# EAGLE design ARE_entrenadora_modular_Arduino_mod (EAGLE 6.5.0)
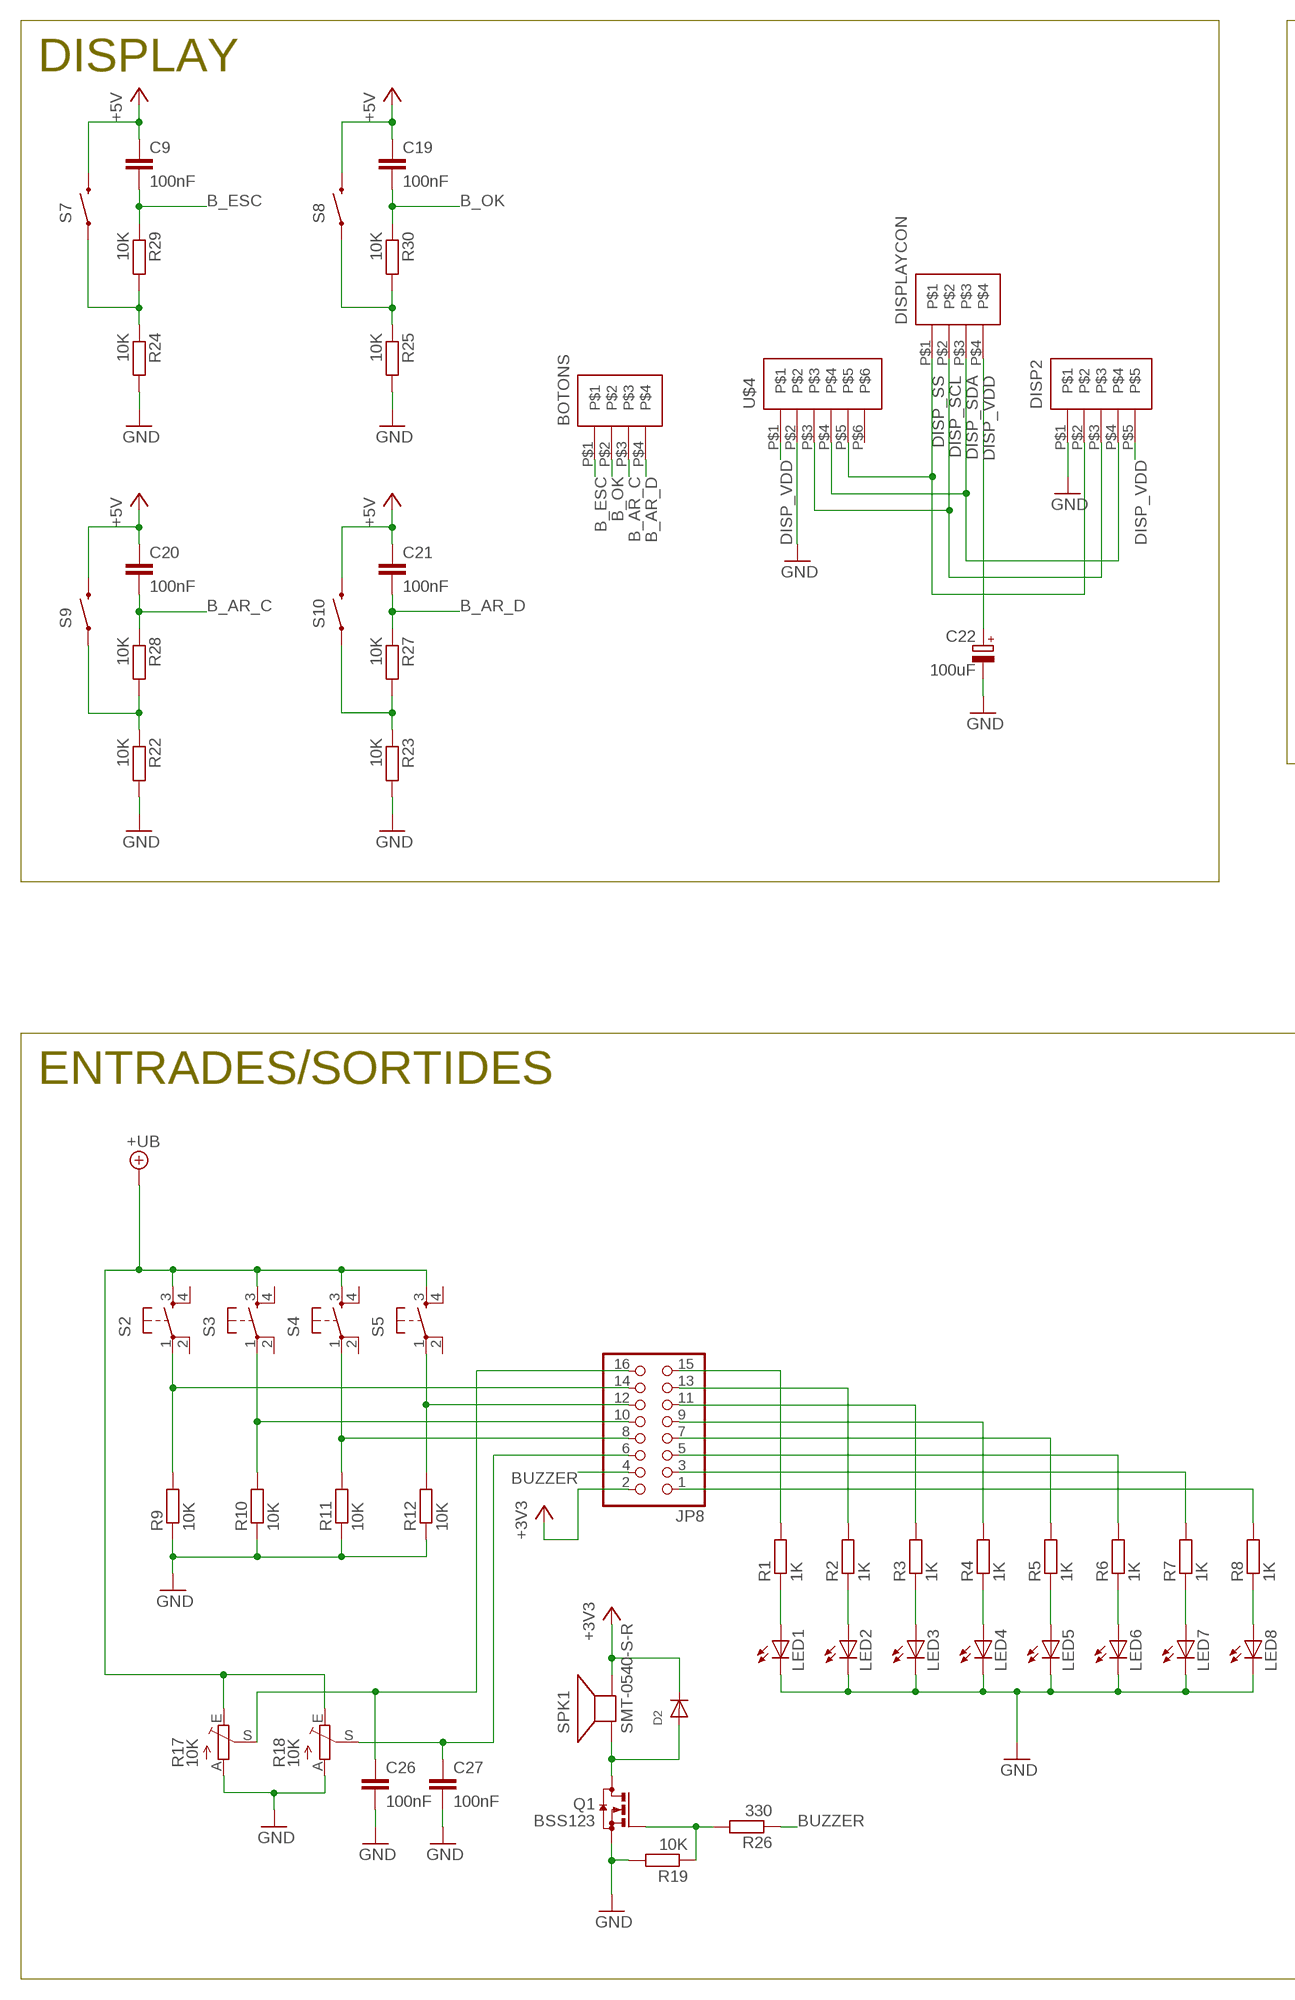
[diagram p0: schematic, sheet 1, part 1 of 2]
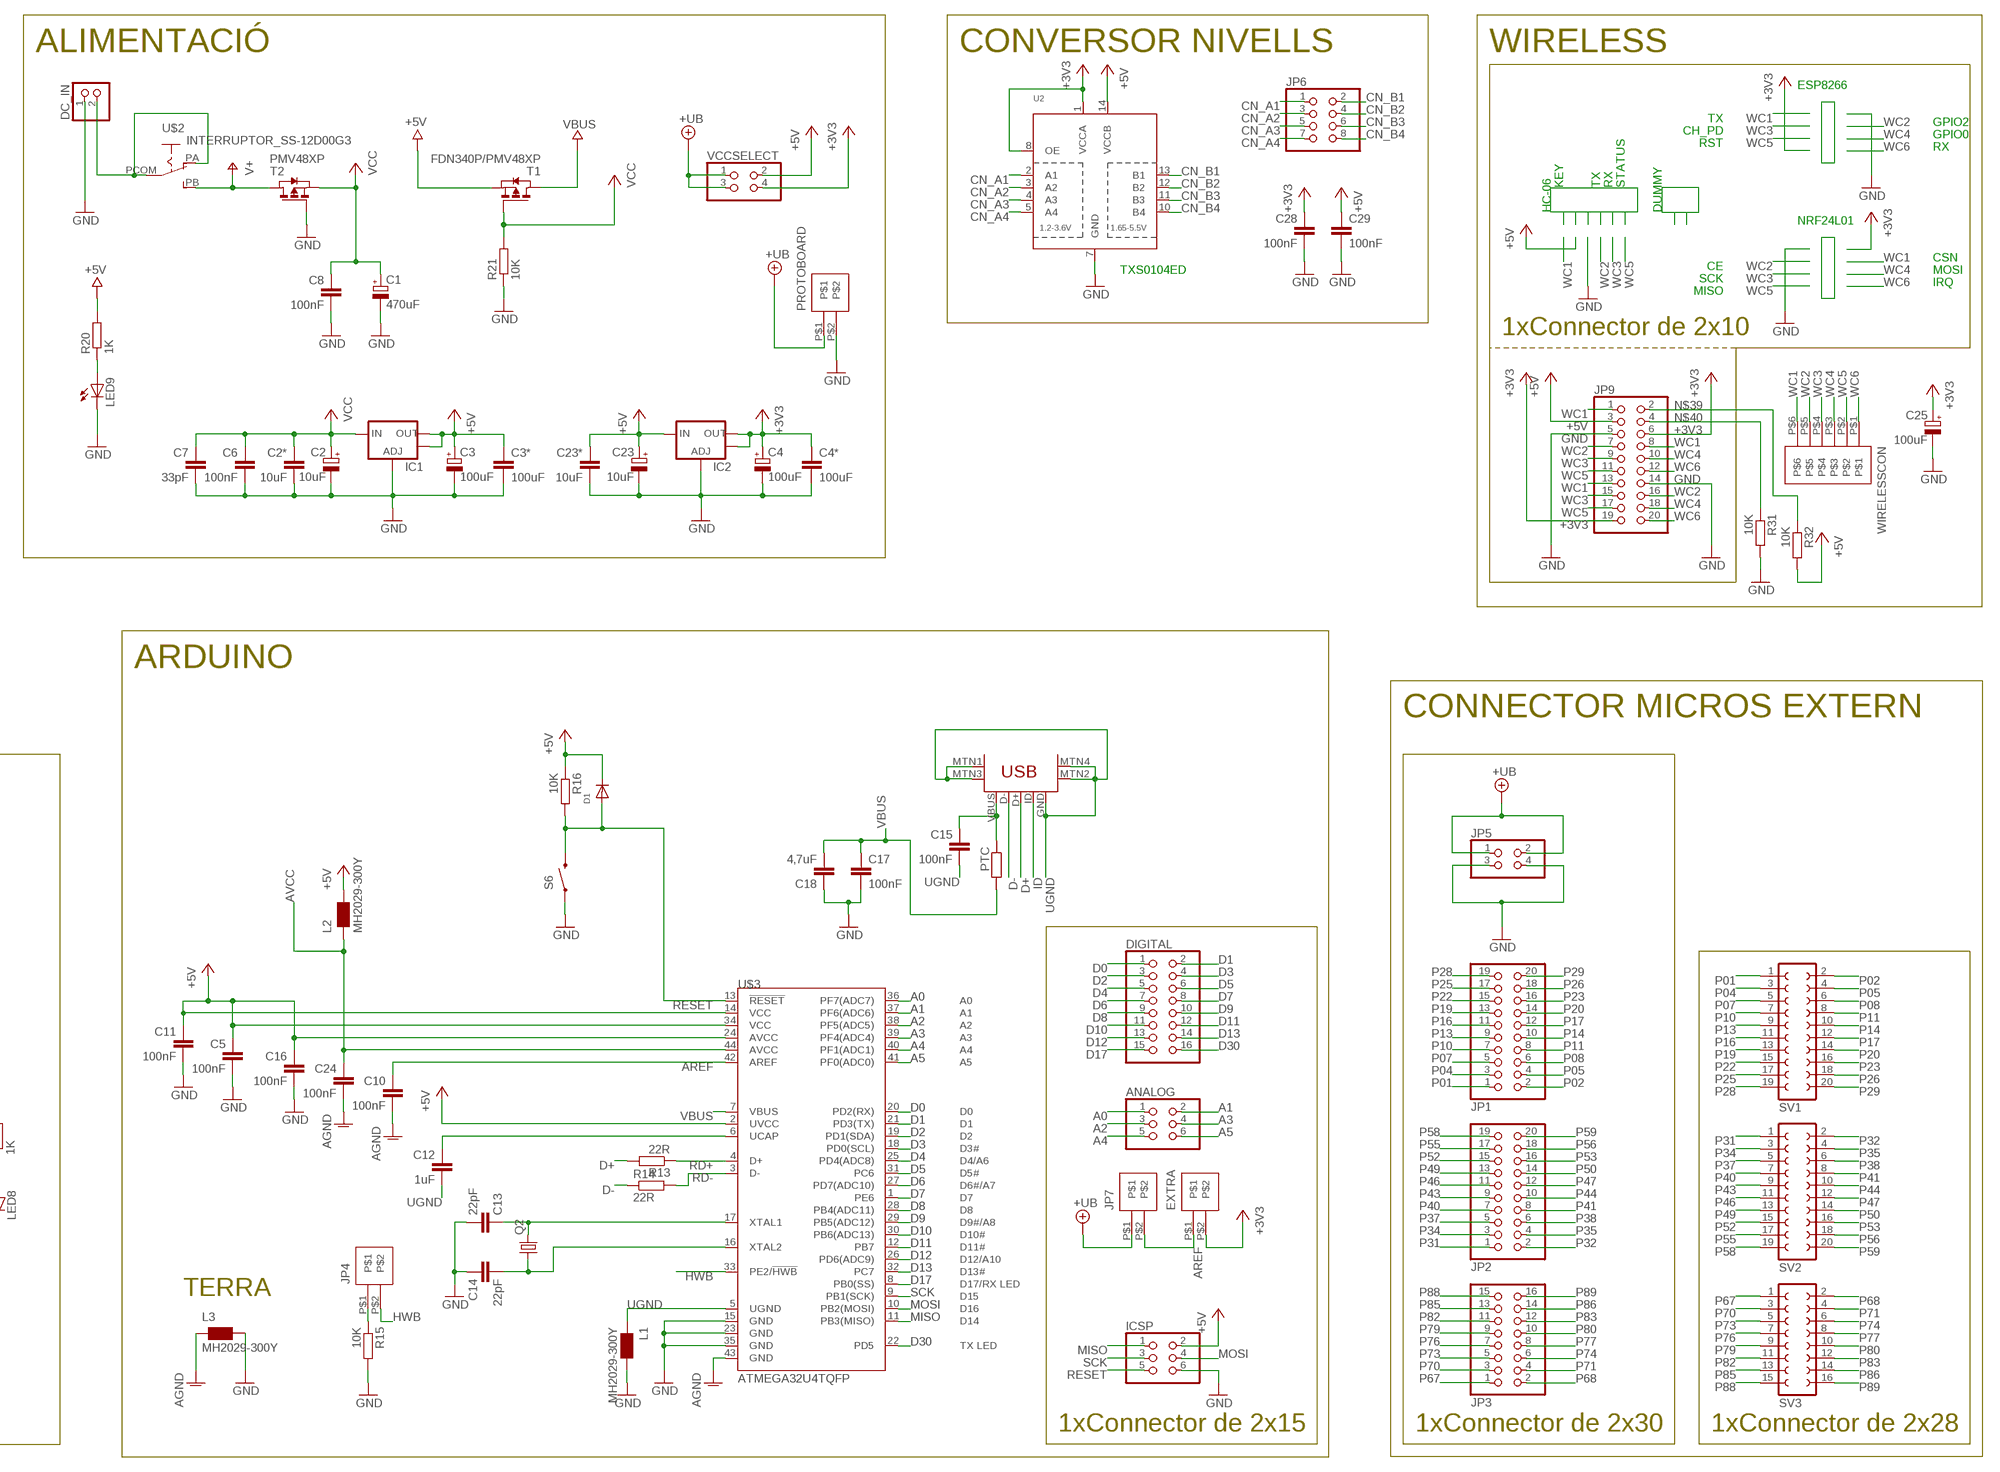
[diagram p1: schematic, sheet 1, part 2 of 2]

## Parts
ANALOG  PINHD-2X3  [2X03]
BOTONS  PINHEAD_1X4  [PINHEAD_1X4_2.54]
C1  470uF  CPOL-EUE3.5-8  [E3,5-8]
C2  10uF  CPOL-EUSMCC  [SMC_C]
C2*  10uF  C-EUC1206  [C1206]
C3  100uF  CPOL-EUCT7343  [CT7343]
C3*  100uF  C-EUC1206  [C1206]
C4  100uF  CPOL-EUCT7343  [CT7343]
C4*  100uF  C-EUC1206  [C1206]
C5  100nF  C-EUC0805  [C0805]
C6  100nF  C-EUC0805  [C0805]
C7  33pF  C-EUC0805  [C0805]
C8  100nF  C-EUC0805  [C0805]
C9  100nF  C-EUC0805  [C0805]
C10  100nF  C-EUC0805  [C0805]
C11  100nF  C-EUC0805  [C0805]
C12  1uF  C-EUC0805  [C0805]
C13  22pF  C-EUC0805  [C0805]
C14  22pF  C-EUC0805  [C0805]
C15  100nF  C-EUC0805  [C0805]
C16  100nF  C-EUC0805  [C0805]
C17  100nF  C-EUC0805  [C0805]
C18  4,7uF  C-EUC0805  [C0805]
C19  100nF  C-EUC0805  [C0805]
C20  100nF  C-EUC0805  [C0805]
C21  100nF  C-EUC0805  [C0805]
C22  100uF  CPOL-EUSMCC  [SMC_C]
C23  10uF  CPOL-EUSMCC  [SMC_C]
C23*  10uF  C-EUC1206  [C1206]
C24  100nF  C-EUC0805  [C0805]
C25  100uF  CPOL-EUSMCC  [SMC_C]
C26  100nF  C-EUC0805  [C0805]
C27  100nF  C-EUC0805  [C0805]
C28  100nF  C-EUC0805  [C0805]
C29  100nF  C-EUC0805  [C0805]
D1  DIODESOD-123  [SOD-123]
D2  DIODESOD-123  [SOD-123]
DC_IN  PINHD-1X2/90  [1X02/90]
DIGITAL  PINHD-2X8  [2X08]
DISP2  PINHEAD_1X5  [PINHEAD_1X5_2.54]
DISPLAYCON  PINHEAD_1X4  [PINHEAD_1X4_2.54]
EXTRA  PINHEAD_1X2  [PINHEAD_1X2_2.54]
IC1  V_REG_LM1117SOT223  [SOT223]
IC2  V_REG_LM1117SOT223  [SOT223]
ICSP  PINHD-2X3  [2X03]
JP1  PINHD-2X10/90  [2X10/90]
JP2  PINHD-2X10/90  [2X10/90]
JP3  PINHD-2X8/90  [2X08/90]
JP4  PINHEAD_1X2  [PINHEAD_1X2_2.54]
JP5  PINHD-2X2/90  [2X02/90]
JP6  PINHD-2X4  [2X04]
JP7  PINHEAD_1X2  [PINHEAD_1X2_2.54]
JP8  PINHD-2X8  [2X08]
JP9  PINHD-2X10  [2X10]
L1  MH2029-300Y  WE-CBF_0805  [0805]
L2  MH2029-300Y  WE-CBF_0805  [0805]
L3  MH2029-300Y  WE-CBF_0805  [0805]
LED1  LEDCHIP-LED0805  [CHIP-LED0805]
LED2  LEDCHIP-LED0805  [CHIP-LED0805]
LED3  LEDCHIP-LED0805  [CHIP-LED0805]
LED4  LEDCHIP-LED0805  [CHIP-LED0805]
LED5  LEDCHIP-LED0805  [CHIP-LED0805]
LED6  LEDCHIP-LED0805  [CHIP-LED0805]
LED7  LEDCHIP-LED0805  [CHIP-LED0805]
LED8  LEDCHIP-LED0805  [CHIP-LED0805]
LED9  LEDCHIP-LED0805  [CHIP-LED0805]
PROTOBOARD  PINHEAD_1X2  [PINHEAD_1X2_2.54]
PTC  R-EU_R1206  [R1206]
Q1  BSS123  [SOT23]
Q2  CRYSTALHC49UP  [HC49UP]
R1  1K  R-EU_R0805  [R0805]
R2  1K  R-EU_R0805  [R0805]
R3  1K  R-EU_R0805  [R0805]
R4  1K  R-EU_R0805  [R0805]
R5  1K  R-EU_R0805  [R0805]
R6  1K  R-EU_R0805  [R0805]
R7  1K  R-EU_R0805  [R0805]
R8  1K  R-EU_R0805  [R0805]
R9  10K  R-EU_R0805  [R0805]
R10  10K  R-EU_R0805  [R0805]
R11  10K  R-EU_R0805  [R0805]
R12  10K  R-EU_R0805  [R0805]
R13  22R  R-EU_R0805  [R0805]
R14  22R  R-EU_R0805  [R0805]
R15  10K  R-EU_R0805  [R0805]
R16  10K  R-EU_R0805  [R0805]
R17  10K  TRIM_EU-CA6V  [CA6V]
R18  10K  TRIM_EU-CA6V  [CA6V]
R19  10K  R-EU_R0805  [R0805]
R20  1K  R-EU_R0805  [R0805]
R21  10K  R-EU_R0805  [R0805]
R22  10K  R-EU_R0805  [R0805]
R23  10K  R-EU_R0805  [R0805]
R24  10K  R-EU_R0805  [R0805]
R25  10K  R-EU_R0805  [R0805]
R26  330  R-EU_R0805  [R0805]
R27  10K  R-EU_R0805  [R0805]
R28  10K  R-EU_R0805  [R0805]
R29  10K  R-EU_R0805  [R0805]
R30  10K  R-EU_R0805  [R0805]
R31  10K  R-EU_R0805  [R0805]
R32  10K  R-EU_R0805  [R0805]
S2  TAC_SWITCHPTH  [TACTILE-PTH]
S3  TAC_SWITCHPTH  [TACTILE-PTH]
S4  TAC_SWITCHPTH  [TACTILE-PTH]
S5  TAC_SWITCHPTH  [TACTILE-PTH]
S6  SWITCH-MOMENTARY-2-SMD-1101NE  [TACTILE-SWITCH-1101NE]
S7  SWITCH-MOMENTARY-2-SMD-1101NE  [TACTILE-SWITCH-1101NE]
S8  SWITCH-MOMENTARY-2-SMD-1101NE  [TACTILE-SWITCH-1101NE]
S9  SWITCH-MOMENTARY-2-SMD-1101NE  [TACTILE-SWITCH-1101NE]
S10  SWITCH-MOMENTARY-2-SMD-1101NE  [TACTILE-SWITCH-1101NE]
SPK1  SMT-0540-S-R  [SMT-0540-S-R]
SV1  FE10-2  [FE10-2]
SV2  FE10-2  [FE10-2]
SV3  FE08-2  [FE08-2]
T1  FDN340P/PMV48XP  PMOSSOT23  [SOT-23]
T2  PMV48XP  PMOSSOT23  [SOT-23]
U2  TXB0104PWRSOIC14  [SO14]
U$1  USB-MINIB-5PIN  [USB-MINIB]
U$2  INTERRUPTOR_SS-12D00G3  [SS-12D00G3]
U$3  ATMEGA32U4TQFP  [SPARKFUN-DIGITALIC_TQFP44]
U$4  PINHEAD_1X6  [PINHEAD_1X6_2.54]
VCCSELECT  PINHD-2X2  [2X02]
WIRELESSCON  PINHEAD_1X6  [PINHEAD_1X6_2.54]

## Nets
+3V3: C4*.1 C4.+ C25.+ C28.1 D2.C EXTRA.P$2 IC2.2(OUT) IC2.4(OUT) JP8.2 JP9.6 JP9.19 SPK1.+(-) U2.1(VCCA) U2.8(OE) VCCSELECT.4
+5V: C3*.1 C3.+ C5.1 C9.1 C11.1 C16.1 C19.1 C20.1 C21.1 C23*.1 C23.+ C29.1 D1.C IC1.2(OUT) IC1.4(OUT) IC2.3(IN) ICSP.2 JP9.3 L2.2 R16.1 R20.2 R32.2 S7.P$2 S8.P$2 S9.P$2 S10.P$2 T1.2(S) U2.14(VCCB) U$3.2(UVCC) U$3.14(VCC) U$3.24(AVCC) U$3.34(VCC) VCCSELECT.2
+UB: JP5.1 JP5.2 JP7.P$1 PROTOBOARD.P$1 R17.E R18.E S2.3 S3.3 S4.3 S5.3 VCCSELECT.1 VCCSELECT.3
A0: ANALOG.1 U$3.36(PF7(ADC7))
A1: ANALOG.2 U$3.37(PF6(ADC6))
A2: ANALOG.3 U$3.38(PF5(ADC5))
A3: ANALOG.4 U$3.39(PF4(ADC4))
A4: ANALOG.5 U$3.40(PF1(ADC1))
A5: ANALOG.6 U$3.41(PF0(ADC0))
AGND: C10.2 C24.2 L3.1 U$3.43(GND)
AREF: C10.1 EXTRA.P$1 JP7.P$2 U$3.42(AREF)
AVCC: C24.1 L2.1 U$3.44(AVCC)
B_AR_C: BOTONS.P$3 C20.2 R28.1
B_AR_D: BOTONS.P$4 C21.2 R27.1
B_ESC: BOTONS.P$1 C9.2 R29.1
B_OK: BOTONS.P$2 C19.2 R30.1
BUZZER: JP8.4 R26.1
CN_A1: JP6.1 U2.2(A1)
CN_A2: JP6.3 U2.3(A2)
CN_A3: JP6.5 U2.4(A3)
CN_A4: JP6.7 U2.5(A4)
CN_B1: JP6.2 U2.13(B1)
CN_B2: JP6.4 U2.12(B2)
CN_B3: JP6.6 U2.11(B3)
CN_B4: JP6.8 U2.10(B4)
D0: DIGITAL.1 U$3.20(PD2(RX))
D1: DIGITAL.2 U$3.21(PD3(TX))
D2: DIGITAL.3 U$3.19(PD1(SDA))
D3: DIGITAL.4 U$3.18(PD0(SCL))
D4: DIGITAL.5 U$3.25(PD4(ADC8))
D5: DIGITAL.6 U$3.31(PC6)
D6: DIGITAL.7 U$3.27(PD7(ADC10))
D7: DIGITAL.8 U$3.1(PE6)
D8: DIGITAL.9 U$3.28(PB4(ADC11))
D9: DIGITAL.10 U$3.29(PB5(ADC12))
D10: DIGITAL.11 U$3.30(PB6(ADC13))
D11: DIGITAL.12 U$3.12(PB7)
D12: DIGITAL.13 U$3.26(PD6(ADC9))
D13: DIGITAL.14 U$3.32(PC7)
D17: DIGITAL.15 U$3.8(PB0(SS))
D30: DIGITAL.16 U$3.22(PD5)
D+: R13.2 U$1.D+
D-: R14.1 U$1.D-
DISP_SCL: DISP2.P$3 DISPLAYCON.P$2 U$4.P$3
DISP_SDA: DISP2.P$4 DISPLAYCON.P$3 U$4.P$4
DISP_SS: DISP2.P$2 DISPLAYCON.P$1 U$4.P$5
DISP_VDD: C22.+ DISP2.P$5 DISPLAYCON.P$4 U$4.P$1
GND: C1.- C2*.2 C2.- C3*.2 C3.- C4*.2 C4.- C5.2 C6.2 C7.2 C8.2 C11.2 C13.2 C14.1 C16.2 C17.2 C18.1 C22.- C23*.2 C23.- C25.- C26.2 C27.2 C28.2 C29.2 DC_IN.1 DISP2.P$1 IC1.1(ADJ) IC2.1(ADJ) ICSP.6 JP5.3 JP5.4 JP9.5 JP9.14 L1.2 L3.2 LED1.C LED2.C LED3.C LED4.C LED5.C LED6.C LED7.C LED8.C LED9.C PROTOBOARD.P$2 Q1.2(S) R9.1 R10.1 R11.1 R12.1 R15.2 R17.A R18.A R19.2 R21.1 R22.2 R23.2 R24.2 R25.2 R31.2 S6.P$1 T2.3(G) U2.7(GND) U$3.15(GND) U$3.23(GND) U$3.35(GND) U$4.P$2
HWB: JP4.P$2 U$3.33(PE2/!HWB)
ID: U$1.ID
MISO: ICSP.1 U$3.11(PB3(MISO))
MOSFET_BASE: Q1.1(G) R19.1 R26.2
MOSI: ICSP.4 U$3.10(PB2(MOSI))
N$1: LED1.A R1.1
N$2: LED2.A R2.1
N$3: LED3.A R3.1
N$4: LED4.A R4.1
N$5: JP8.13 R2.2
N$6: JP8.11 R3.2
N$7: JP8.15 R1.2
N$8: JP8.9 R4.2
N$9: LED9.A R20.1
N$10: C27.1 JP8.6 R18.S
N$11: D2.A Q1.3(D) SPK1.-(+)
N$12: JP4.P$1 R15.1
N$13: C13.1 Q2.2 U$3.17(XTAL1)
N$14: C14.2 Q2.1 U$3.16(XTAL2)
N$15: R22.1 R28.2 S9.P$1
N$16: JP8.8 R11.2 S4.1
N$17: JP8.12 R12.2 S5.1
N$18: C15.1 PTC.1 U$1.VBUS
N$19: R24.1 R29.2 S7.P$1
N$20: LED5.A R5.1
N$23: R25.1 R30.2 S8.P$1
N$25: JP8.10 R10.2 S3.1
N$26: R23.1 R27.2 S10.P$1
N$27: C12.1 U$3.6(UCAP)
N$39: JP9.2 R32.1
N$40: JP9.4 R31.1
N$42: DC_IN.2 U$2.PA U$2.PCOM
N$44: LED6.A R6.1
N$45: LED7.A R7.1
N$46: LED8.A R8.1
N$47: JP8.14 R9.2 S2.1
N$57: C26.1 JP8.16 R17.S
N$62: JP8.5 R6.2
N$63: JP8.3 R7.2
N$64: JP8.7 R5.2
N$65: JP8.1 R8.2
P01: JP1.1 SV1.1
P02: JP1.2 SV1.2
P04: JP1.3 SV1.3
P05: JP1.4 SV1.4
P07: JP1.5 SV1.5
P08: JP1.6 SV1.6
P10: JP1.7 SV1.7
P11: JP1.8 SV1.8
P13: JP1.9 SV1.9
P14: JP1.10 SV1.10
P16: JP1.11 SV1.11
P17: JP1.12 SV1.12
P19: JP1.13 SV1.13
P20: JP1.14 SV1.14
P22: JP1.15 SV1.15
P23: JP1.16 SV1.16
P25: JP1.17 SV1.17
P26: JP1.18 SV1.18
P28: JP1.19 SV1.19
P29: JP1.20 SV1.20
P31: JP2.1 SV2.1
P32: JP2.2 SV2.2
P34: JP2.3 SV2.3
P35: JP2.4 SV2.4
P37: JP2.5 SV2.5
P38: JP2.6 SV2.6
P40: JP2.7 SV2.7
P41: JP2.8 SV2.8
P43: JP2.9 SV2.9
P44: JP2.10 SV2.10
P46: JP2.11 SV2.11
P47: JP2.12 SV2.12
P49: JP2.13 SV2.13
P50: JP2.14 SV2.14
P52: JP2.15 SV2.15
P53: JP2.16 SV2.16
P55: JP2.17 SV2.17
P56: JP2.18 SV2.18
P58: JP2.19 SV2.19
P59: JP2.20 SV2.20
P67: JP3.1 SV3.1
P68: JP3.2 SV3.2
P70: JP3.3 SV3.3
P71: JP3.4 SV3.4
P73: JP3.5 SV3.5
P74: JP3.6 SV3.6
P76: JP3.7 SV3.7
P77: JP3.8 SV3.8
P79: JP3.9 SV3.9
P80: JP3.10 SV3.10
P82: JP3.11 SV3.11
P83: JP3.12 SV3.12
P85: JP3.13 SV3.13
P86: JP3.14 SV3.14
P88: JP3.15 SV3.15
P89: JP3.16 SV3.16
RD+: R13.1 U$3.4(D+)
RD-: R14.2 U$3.3(D-)
RESET: D1.A ICSP.5 R16.2 S6.P$2 U$3.13(!RESET)
SCK: ICSP.3 U$3.9(PB1(SCK))
UGND: C12.2 C15.2 L1.1 U$1.GND U$1.MTN1(MTN2) U$1.MTN2(MTN3) U$1.MTN3(MTN1) U$1.MTN4 U$3.5(UGND)
V+: T2.1(D) U$2.PB
VBUS: C17.1 C18.2 PTC.2 T1.1(D) U$3.7(VBUS)
VCC: C1.+ C2*.1 C2.+ C6.1 C7.1 C8.1 IC1.3(IN) R21.2 T1.3(G) T2.2(S)
WC1: JP9.1 JP9.8 JP9.13 WIRELESSCON.P$6
WC2: JP9.7 JP9.16 WIRELESSCON.P$5
WC3: JP9.9 JP9.15 WIRELESSCON.P$4
WC4: JP9.10 JP9.18 WIRELESSCON.P$3
WC5: JP9.11 JP9.17 WIRELESSCON.P$2
WC6: JP9.12 JP9.20 WIRELESSCON.P$1
Unconnected: S2.2 S2.4 S3.2 S3.4 S4.2 S4.4 S5.2 S5.4 U$4.P$6

## Notes on the sheet
- DISPLAY | ALIMENTACIÓ | CONVERSOR NIVELLS | WIRELESS
- ESP8266
- TX
- CH_PD | GPIO2
- RST | GPIO0
- RX
- KEY | TX | RX | STATUS
- HC-06 | DUMMY
- NRF24L01
- CE | CSN
- TXS0104ED | SCK | MOSI
- MISO | IRQ
- 1xConnector de 2x10
- ARDUINO
- CONNECTOR MICROS EXTERN
- ENTRADES/SORTIDES
- TERRA
- 1xConnector de 2x15 | 1xConnector de 2x30 | 1xConnector de 2x28

## Library data of the parts
ANALOG ICSP = pinhead:PINHD-2X3: PIN HEADER
BOTONS DISPLAYCON = ARE_connectors:PINHEAD_1X4
C1-C4 C22 C23 C25 = rcl:CPOL-EU: POLARIZED CAPACITOR, European symbol
C2* C3* C4* C5-C21 C23* C24 C26-C29 = rcl:C-EU: CAPACITOR, European symbol
D1 D2 = adafruit:DIODE: Diode SMADIODE - SMA Surface Mount Package 20V 1A Schottky Diode Digikey: 641-1014-6-ND DO-1N4148 - Through Hole Small Current Diode SOD-123 20V 1 A (.5mV Vf) Schottky Diode - Digikey: MBRX120TPMSCT-ND SOD-323 10V 570mA (.38mV Vf, 3ns) Schottky Diode - Digikey: ZLLS410CT-ND SOD-523 30V 30mA Schottky Diode (RB751S-40TE61) - Digikey: RB751S-40TE61CT-ND SOT23-R/W - SOT23 Package (R = Solder Paste/Reflow Ovens, W = Hand-Soldering) BAT54Film 40V 300mA - Digikey: 497-7162-1-ND
DC_IN = pinhead:PINHD-1X2: PIN HEADER
DIGITAL JP3 JP8 = pinhead:PINHD-2X8: PIN HEADER
DISP2 = ARE_connectors:PINHEAD_1X5
EXTRA JP4 JP7 PROTOBOARD = ARE_connectors:PINHEAD_1X2
IC1 IC2 = SparkFun:V_REG_LM1117: Voltage Regulator LM1117 Standard adjustable voltage regulator but in SMD form. Spark Fun Electronics SKU : COM-00595
JP1 JP2 JP9 = pinhead:PINHD-2X10: PIN HEADER
JP5 VCCSELECT = pinhead:PINHD-2X2: PIN HEADER
JP6 = pinhead:PINHD-2X4: PIN HEADER
L1-L3 = wuerth-elektronik:WE-CBF: SMD EMI Suppression Ferrite Beads - excellent anti-EMI properties - low DCR - impedances till 3000 ohms - rated current up to 6 A
LED1-LED9 = led:LED: LED OSRAM: - CHIPLED LG R971, LG N971, LY N971, LG Q971, LY Q971, LO R971, LY R971 LH N974, LH R974 LS Q976, LO Q976, LY Q976 LO Q996 - Hyper CHIPLED LW Q18S LB Q993, LB Q99A, LB R99A - SideLED LS A670, LO A670, LY A670, LG A670, LP A670 LB A673, LV A673, LT A673, LW A673 LH A674 LY A675 LS A676, LA A676, LO A676, LY A676, LW A676 LS A679, LY A679, LG A679 - Hyper Micro SIDELED® LS Y876, LA Y876, LO Y876, LY Y876 LT Y87S - SmartLED LW L88C, LW L88S LB L89C, LB L89S, LG L890 LS L89K, LO L89K, LY L89K LS L896, LA L896, LO L896, LY L896 - TOPLED LS T670, LO T670, LY T670, LG T670, LP T670 LSG T670, LSP T670, LSY T670, LOP T670, LYG T670 LG T671, LOG T671, LSG T671 LB T673, LV T673, LT T673, LW T673 LH T674 LS T676, LA T676, LO T676, LY T676, LB T676, LH T676, LSB T676, LW T676 LB T67C, LV T67C, LT T67C, LS T67K, LO T67K, LY T67K, LW E67C LS E67B, LA E67B, LO E67B, LY E67B, LB E67C, LV E67C, LT E67C LW T67C LS T679, LY T679, LG T679 LS T770, LO T770, LY T770, LG T770, LP T770 LB T773, LV T773, LT T773, LW T773 LH T774 LS E675, LA E675, LY E675, LS T675 LS T776, LA T776, LO T776, LY T776, LB T776 LHGB T686 LT T68C, LB T68C - Hyper Mini TOPLED® LB M676 - Mini TOPLED Santana® LG M470 LS M47K, LO M47K, LY M47K Source: http://www.osram.convergy.de LUXEON: - LUMILED® LXK2-PW12-R00, LXK2-PW12-S00, LXK2-PW14-U00, LXK2-PW14-V00 LXK2-PM12-R00, LXK2-PM12-S00, LXK2-PM14-U00 LXK2-PE12-Q00, LXK2-PE12-R00, LXK2-PE12-S00, LXK2-PE14-T00, LXK2-PE14-U00 LXK2-PB12-K00, LXK2-PB12-L00, LXK2-PB12-M00, LXK2-PB14-N00, LXK2-PB14-P00, LXK2-PB14-Q00 LXK2-PR12-L00, LXK2-PR12-M00, LXK2-PR14-Q00, LXK2-PR14-R00 LXK2-PD12-Q00, LXK2-PD12-R00, LXK2-PD12-S00 LXK2-PH12-R00, LXK2-PH12-S00 LXK2-PL12-P00, LXK2-PL12-Q00, LXK2-PL12-R00 Source: www.luxeon.com KINGBRIGHT: KA-3528ASYC Source: www.kingbright.com
PTC R1-R16 R19-R32 = rcl:R-EU_: RESISTOR, European symbol
Q1 = transistor-small-signal:BSS123: N-CHANNEL MOS FET
Q2 = crystal:CRYSTAL: CRYSTAL; OC_FARNELL: unknown; OC_NEWARK: unknown
R17 R18 = pot:TRIM_EU-: POTENTIOMETER
S2-S5 = SparkFun:TAC_SWITCH: Momentary Switch Button commonly used for reset or general input. Spark Fun Electronics SKU : COM-00097
S6-S10 = SparkFun-Electromechanical:SWITCH-MOMENTARY-2: Various NO switches- pushbuttons, reed, etc
SPK1 = adafruit:SMT-0540-S-R: SMT-0549-S-R Small surface-mount magnetic buzzer
SV1 SV2 = con-lsta:FE10-2: FEMALE HEADER; OC_FARNELL: unknown; OC_NEWARK: unknown
SV3 = con-lsta:FE08-2: FEMALE HEADER; OC_FARNELL: unknown; OC_NEWARK: unknown
T1 T2 = zetex:PMOSSOT23: MOS FET
U2 = adafruit:TXB0104PWR: 4-Bit Bi-Directional Level Shifter 1.2V-3.6V (VCCA) to 1.65V-5.5V (VCCB) bi-directional level shifter with auto direction sensing. Max data rate - VCCA 1.8V: 20Mbps (50ns), VCCA 3.3V: 100Mbps (10ns) Digikey: 296-21929-1-ND
U$1 = SparkFun-Connectors:USB-MINIB: Mini-USB "B" connector with 5th pin broken out. Created new symbol breaking out 5th "ID" pin in mini/micro USB connector spec. See: http://en.wikipedia.org/wiki/Mini_usb#Cables. Uses same footprint as 4-pin symbol. Also added pins to connect to mounting / shield pads if required (probably not generally needed as signals aren't shielded once they leave the connector).
U$2 = ARE_connectors:INTERRUPTOR_SS-12D00G3
U$3 = SparkFun-DigitalIC:ATMEGA32U4: Atmel 44-pin 8-bit Microcontroller with 32KBytes of ISP Flash and USB Controller
U$4 WIRELESSCON = ARE_connectors:PINHEAD_1X6

## Board
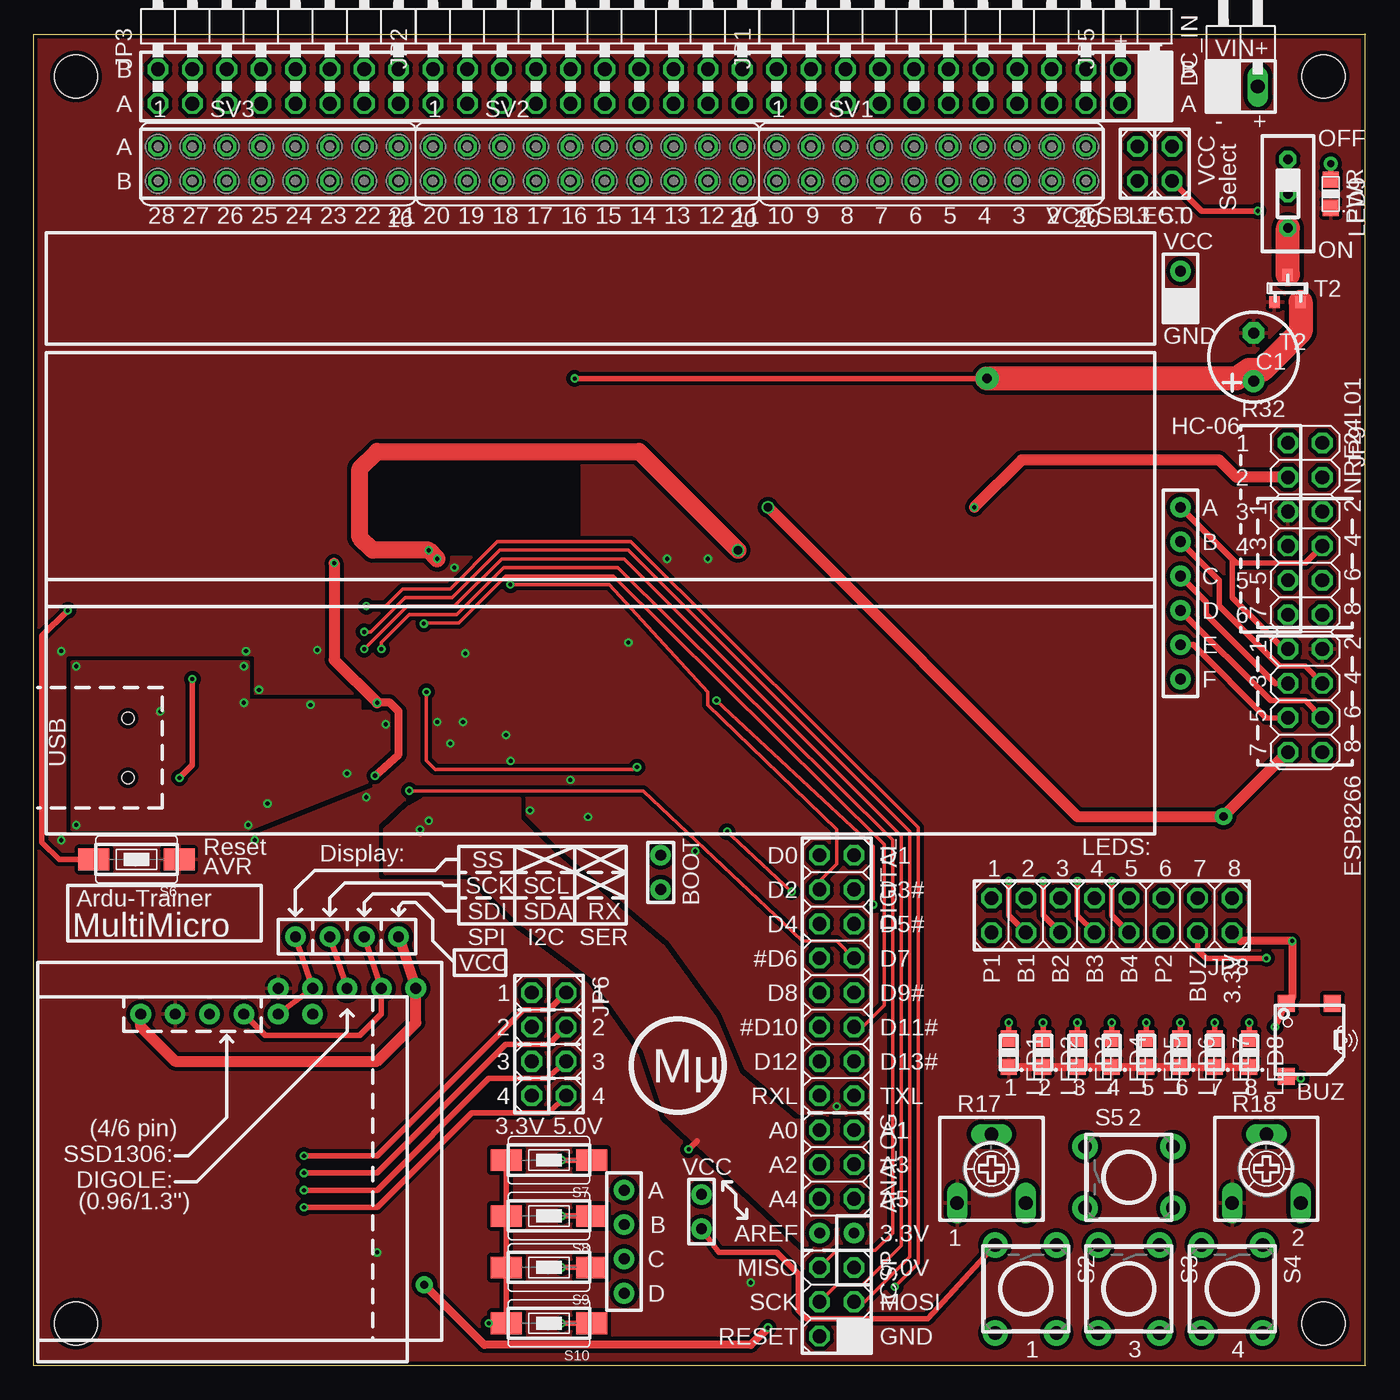
[diagram p2: board, top side]
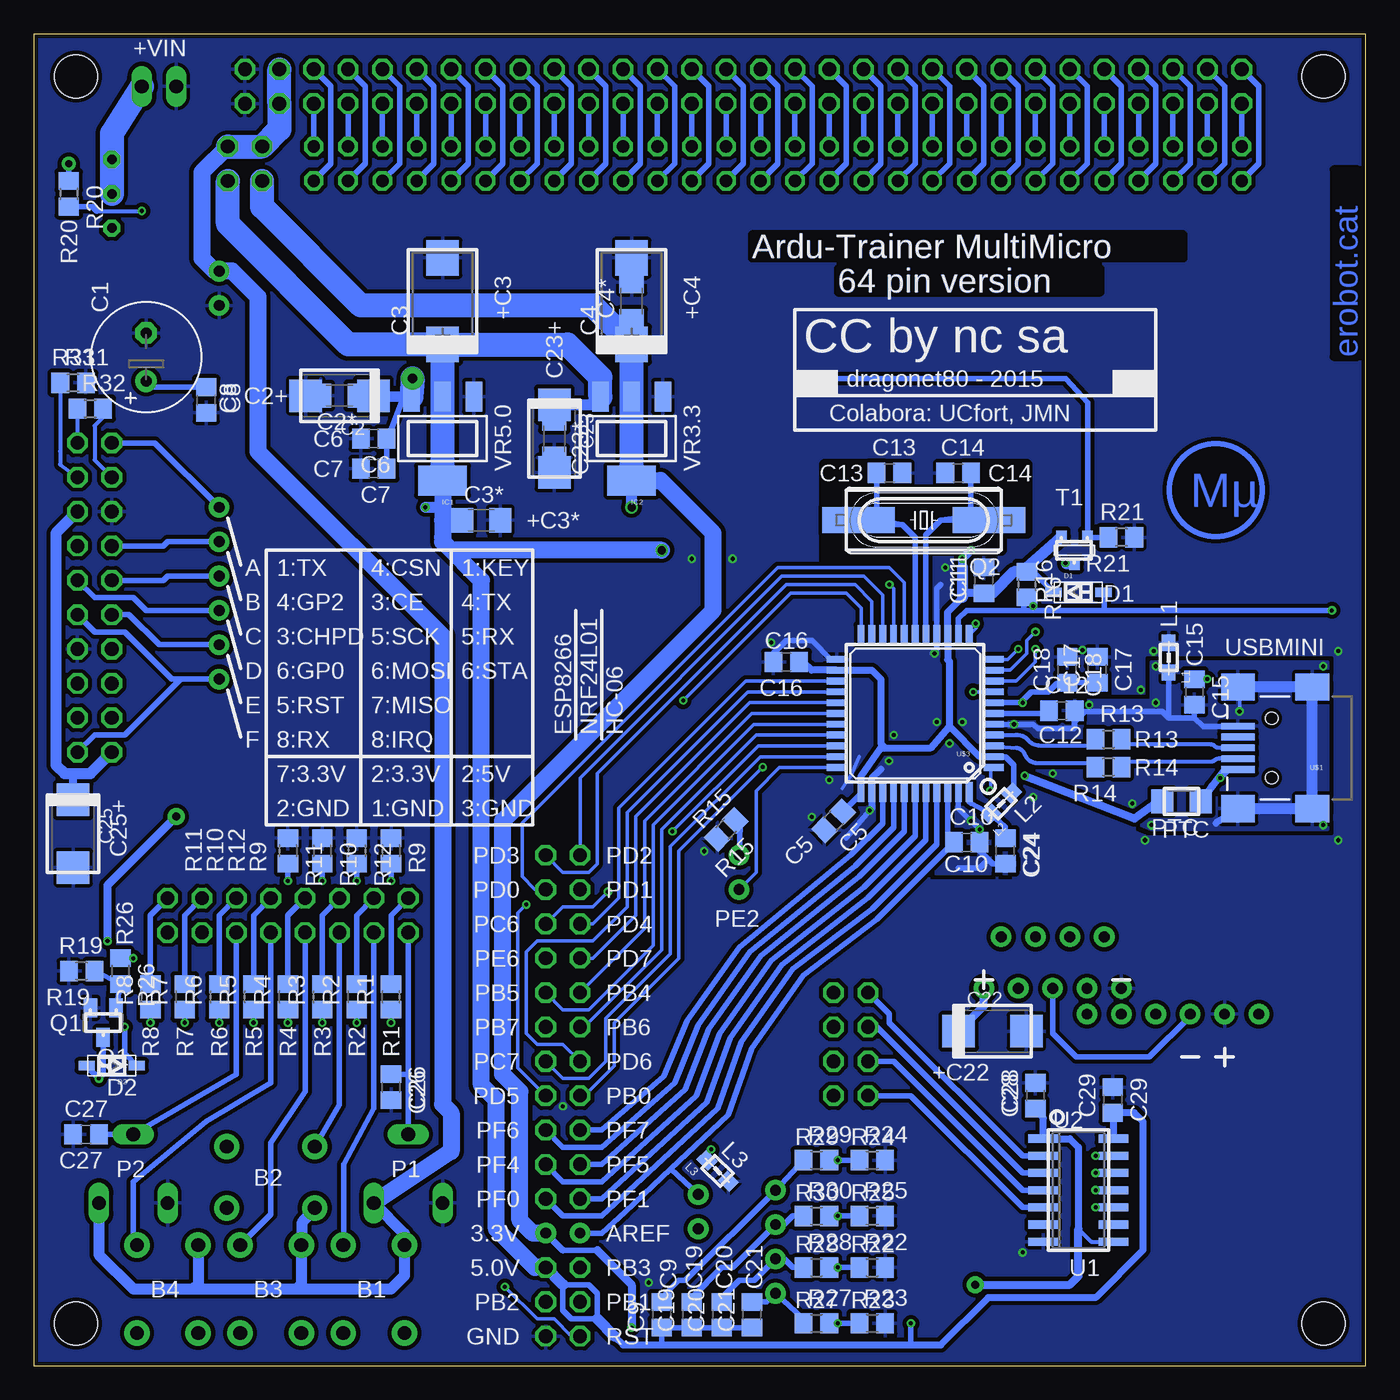
[diagram p3: board, bottom side, seen from below]

Size 98.44 x 98.46 mm. Coordinates in mm from the lower left corner, seen from the top.
Outline: 98.44,98.44 0,98.44 0,0 98.44,0
Outline: 98.39,0.04 98.39,98.46
Copper layers (1*16): Top 0.035mm / dielectric 1.5mm / Bottom 0.035mm
Design rules "ITEADstudio_DRC": minimum track width 6mil, minimum drill 12mil, track to track 6mil, track to pad 6mil, pad to pad 6mil, via to via 6mil, smd to smd 0mil, copper to edge 10mil, drill to drill 10mil, minimum pad ring 10mil, minimum via ring 6mil, stop-mask expansion 2mil, vias tented up to drill 100mil, thermal gap 10mil
Holes 3.2 mm at 3.12,3.12 3.12,95.31 95.31,3.12 95.31,95.31
tRestrict: area 25,60.3 to 40,66.6
bRestrict: area 25,59.6 to 40,66.6

### Footprints (pad centres in the part's own frame; a part is rotated, then mirrored left to right if it is on the bottom)
2X03 = drill 1.016 octagon: 1 -2.54,-1.27; 2 -2.54,1.27; 3 0,-1.27; 4 0,1.27; 5 2.54,-1.27; 6 2.54,1.27
PINHEAD_1X4_2.54 = drill 0.8 pad 1.524: P$1 -3.81,0; P$2 -1.27,0; P$3 1.27,0; P$4 3.81,0
E3,5-8 = drill 0.813 pad 1.6: + -1.778,0 | drill 0.813 pad 1.6 octagon: - 1.778,0
SMC_C = smd 2.4 x 2.4: + -2.5,0; - 2.5,0
C1206 = smd 1.6 x 1.8: 1 -1.4,0; 2 1.4,0
CT7343 = smd 2.6 x 2.4: + -3.2,0; - 3.2,0
C0805 = smd 1.3 x 1.5: 1 -0.95,0; 2 0.95,0
SOD-123 = smd 1.2 x 0.7: A 1.85,0; C -1.85,0
1X02/90 = drill 1.016 long: 1 -1.27,-3.81; 2 1.27,-3.81
2X08 = drill 1.016 octagon: 1 -8.89,-1.27; 2 -8.89,1.27; 3 -6.35,-1.27; 4 -6.35,1.27; 5 -3.81,-1.27; 6 -3.81,1.27; 7 -1.27,-1.27; 8 -1.27,1.27; 9 1.27,-1.27; 10 1.27,1.27; 11 3.81,-1.27; 12 3.81,1.27; 13 6.35,-1.27; 14 6.35,1.27; 15 8.89,-1.27; 16 8.89,1.27
PINHEAD_1X5_2.54 = drill 0.8 pad 1.524: P$1 -5.08,0; P$2 -2.54,0; P$3 0,0; P$4 2.54,0; P$5 5.08,0
PINHEAD_1X2_2.54 = drill 0.8 pad 1.524: P$1 -1.27,0; P$2 1.27,0
SOT223 = smd 1.219 x 2.235: 1 -2.311,-3.099; 2 0,-3.099; 3 2.311,-3.099 | smd 3.6 x 2.2: 4 0,3.099
2X10/90 = drill 1.016 octagon: 1 -11.43,-6.35; 2 -11.43,-3.81; 3 -8.89,-6.35; 4 -8.89,-3.81; 5 -6.35,-6.35; 6 -6.35,-3.81; 7 -3.81,-6.35; 8 -3.81,-3.81; 9 -1.27,-6.35; 10 -1.27,-3.81; 11 1.27,-6.35; 12 1.27,-3.81; 13 3.81,-6.35; 14 3.81,-3.81; 15 6.35,-6.35; 16 6.35,-3.81; 17 8.89,-6.35; 18 8.89,-3.81; 19 11.43,-6.35; 20 11.43,-3.81
2X08/90 = drill 1.016 octagon: 1 -8.89,-6.35; 2 -8.89,-3.81; 3 -6.35,-6.35; 4 -6.35,-3.81; 5 -3.81,-6.35; 6 -3.81,-3.81; 7 -1.27,-6.35; 8 -1.27,-3.81; 9 1.27,-6.35; 10 1.27,-3.81; 11 3.81,-6.35; 12 3.81,-3.81; 13 6.35,-6.35; 14 6.35,-3.81; 15 8.89,-6.35; 16 8.89,-3.81
2X02/90 = drill 1.016 octagon: 1 -1.27,-6.35; 2 -1.27,-3.81; 3 1.27,-6.35; 4 1.27,-3.81
2X04 = drill 1.016 octagon: 1 -3.81,-1.27; 2 -3.81,1.27; 3 -1.27,-1.27; 4 -1.27,1.27; 5 1.27,-1.27; 6 1.27,1.27; 7 3.81,-1.27; 8 3.81,1.27
2X10 = drill 1.016 octagon: 1 -11.43,-1.27; 2 -11.43,1.27; 3 -8.89,-1.27; 4 -8.89,1.27; 5 -6.35,-1.27; 6 -6.35,1.27; 7 -3.81,-1.27; 8 -3.81,1.27; 9 -1.27,-1.27; 10 -1.27,1.27; 11 1.27,-1.27; 12 1.27,1.27; 13 3.81,-1.27; 14 3.81,1.27; 15 6.35,-1.27; 16 6.35,1.27; 17 8.89,-1.27; 18 8.89,1.27; 19 11.43,-1.27; 20 11.43,1.27
0805 = smd 1.2 x 1: 1 -1.1,0; 2 1.1,0
CHIP-LED0805 = smd 1.2 x 1.2: A 0,-1.05; C 0,1.05
R1206 = smd 1.6 x 1.803: 1 -1.422,0; 2 1.422,0
SOT23 = smd 1 x 1.4: 1 -0.95,-1.1; 2 0.95,-1.1; 3 0,1.1
HC49UP = smd 5.334 x 1.93: 1 -4.826,0; 2 4.826,0
R0805 = smd 1.3 x 1.5: 1 -0.95,0; 2 0.95,0
CA6V = drill 1.016 long: A -2.54,-2.54; E 2.54,-2.54; S 0,2.54
TACTILE-PTH = drill 1.016 pad 1.88: 1 -3.251,2.261; 2 3.251,2.261; 3 -3.251,-2.261; 4 3.251,-2.261
TACTILE-SWITCH-1101NE = smd 2.3 x 1.6: P$1 -3.15,0; P$2 3.15,0
SMT-0540-S-R = smd 1.27 x 1.27: + 1.7,-2.7; - 1.7,2.7; M -1.7,-2.7
FE10-2 = drill 0.914 octagon: 1 -11.43,1.27; 2 -11.43,-1.27; 3 -8.89,1.27; 4 -8.89,-1.27; 5 -6.35,1.27; 6 -6.35,-1.27; 7 -3.81,1.27; 8 -3.81,-1.27; 9 -1.27,1.27; 10 -1.27,-1.27; 11 1.27,1.27; 12 1.27,-1.27; 13 3.81,1.27; 14 3.81,-1.27; 15 6.35,1.27; 16 6.35,-1.27; 17 8.89,1.27; 18 8.89,-1.27; 19 11.43,1.27; 20 11.43,-1.27
FE08-2 = drill 0.914 octagon: 1 -8.89,1.27; 2 -8.89,-1.27; 3 -6.35,1.27; 4 -6.35,-1.27; 5 -3.81,1.27; 6 -3.81,-1.27; 7 -1.27,1.27; 8 -1.27,-1.27; 9 1.27,1.27; 10 1.27,-1.27; 11 3.81,1.27; 12 3.81,-1.27; 13 6.35,1.27; 14 6.35,-1.27; 15 8.89,1.27; 16 8.89,-1.27
SOT-23 = smd 0.787 x 0.889: 1 0.025,-1.016; 2 -0.94,1.016; 3 0.991,1.016
SO14 = smd 0.6 x 2.2: 1 -3.81,-2.6; 2 -2.54,-2.6; 3 -1.27,-2.6; 4 0,-2.6; 5 1.27,-2.6; 6 2.54,-2.6; 7 3.81,-2.6; 8 3.81,2.6; 9 2.54,2.6; 10 1.27,2.6; 11 0,2.6; 12 -1.27,2.6; 13 -2.54,2.6; 14 -3.81,2.6
USB-MINIB = smd 2.5 x 0.5: D+ 2.5,0; D- 2.5,0.8; GND 2.5,-1.6; ID 2.5,-0.8; VBUS 2.5,1.6 | smd 2.5 x 2: MTN1 -3,4.5; MTN2 2.5,4.5; MTN3 -3,-4.5; MTN4 2.5,-4.5 | hole 0.9: 0,2.2; 0,-2.2
SS-12D00G3 = drill 0.7 pad 1.27 octagon: PA -2.54,0; PB 2.54,0; PCOM 0,0
SPARKFUN-DIGITALIC_TQFP44 = smd 1.5 x 0.5: 1 -5.8,4; 2 -5.8,3.2; 3 -5.8,2.4; 4 -5.8,1.6; 5 -5.8,0.8; 6 -5.8,0; 7 -5.8,-0.8; 8 -5.8,-1.6; 9 -5.8,-2.4; 10 -5.8,-3.2; 11 -5.8,-4; 23 5.8,-4; 24 5.8,-3.2; 25 5.8,-2.4; 26 5.8,-1.6; 27 5.8,-0.8; 28 5.8,0; 29 5.8,0.8; 30 5.8,1.6; 31 5.8,2.4; 32 5.8,3.2; 33 5.8,4 | smd 0.5 x 1.5: 12 -4,-5.8; 13 -3.2,-5.8; 14 -2.4,-5.8; 15 -1.6,-5.8; 16 -0.8,-5.8; 17 0,-5.8; 18 0.8,-5.8; 19 1.6,-5.8; 20 2.4,-5.8; 21 3.2,-5.8; 22 4,-5.8; 34 4,5.8; 35 3.2,5.8; 36 2.4,5.8; 37 1.6,5.8; 38 0.8,5.8; 39 0,5.8; 40 -0.8,5.8; 41 -1.6,5.8; 42 -2.4,5.8; 43 -3.2,5.8; 44 -4,5.8
PINHEAD_1X6_2.54 = drill 0.8 pad 1.524: P$1 -6.35,0; P$2 -3.81,0; P$3 -1.27,0; P$4 1.27,0; P$5 3.81,0; P$6 6.35,0
2X02 = drill 1.016 octagon: 1 -1.27,-1.27; 2 -1.27,1.27; 3 1.27,-1.27; 4 1.27,1.27

### Placement (x,y rotation side)
ANALOG  59.34,14.88 270 top
BOTONS  43.62,9.16 270 top
C1  90.14,74.57 90 bottom
C2  75.85,71.71 180 bottom
C2*  75.85,71.71 180 bottom
C3  68.23,78.7 90 bottom
C3*  65.37,62.5 0 bottom
C4  54.26,78.7 90 bottom
C4*  54.26,78.7 90 bottom
C5  39.34,40.28 225 bottom
C6  73.31,68.54 180 bottom
C7  73.31,66.31 180 bottom
C8  85.69,71.39 270 bottom
C9  52.04,3.77 90 bottom
C10  29.49,38.69 0 bottom
C11  28.22,58.06 90 bottom
C12  22.46,48.42 0 bottom
C13  35.21,66 0 bottom
C14  30.13,66 0 bottom
C15  12.67,49.8 270 bottom
C16  42.83,52.03 180 bottom
C17  19.84,51.45 90 bottom
C18  22.06,51.45 270 bottom
C19  49.81,3.77 90 bottom
C20  47.59,3.77 90 bottom
C21  45.37,3.77 90 bottom
C22  27.59,24.72 0 bottom
C23  59.98,68.54 270 bottom
C23*  59.98,68.54 270 bottom
C24  26.64,38.06 270 bottom
C25  95.54,39.33 270 bottom
C26  72.04,20.59 270 bottom
C27  94.58,17.1 180 bottom
C28  24.41,19.96 90 bottom
C29  18.7,19.64 90 bottom
D1  21.24,57.19 0 bottom
D2  92.68,22.18 180 bottom
DC_IN  89.19,98.38 0 top
DIGITAL  59.34,28.85 270 top
DISP2  23.14,27.9 0 top
DISPLAYCON  23.14,31.71 0 top
EXTRA  59.34,9.8 0 top
IC1  68.23,68.54 180 bottom
IC2  54.26,68.54 180 bottom
ICSP  59.34,4.72 270 top
JP1  66.33,99.65 0 top
JP2  40.92,99.65 0 top
JP3  18.06,99.65 0 top
JP4  46.32,36.47 270 top
JP5  81.57,99.65 0 top
JP6  38.07,23.77 270 top
JP7  49.34,11.39 90 top
JP8  79.66,33.29 180 top
JP9  93.95,56.79 270 top
L1  14.57,52.34 90 bottom
L2  26.95,41.55 45 bottom
L3  47.91,14.4 315 bottom
LED1  72.04,23.13 180 top
LED2  74.58,23.13 180 top
LED3  77.12,23.13 180 top
LED4  79.66,23.13 180 top
LED5  82.2,23.13 180 top
LED6  84.74,23.13 180 top
LED7  87.28,23.13 180 top
LED8  89.82,23.13 180 top
LED9  95.85,86.63 180 top
PROTOBOARD  84.74,79.65 270 top
PTC  13.62,41.71 180 bottom
Q1  93.31,25.36 180 bottom
Q2  32.67,62.5 180 bottom
R1  72.04,27.26 90 bottom
R2  74.58,27.26 90 bottom
R3  77.12,27.26 90 bottom
R4  79.66,27.26 90 bottom
R5  82.2,27.26 90 bottom
R6  84.74,27.26 90 bottom
R7  87.28,27.26 90 bottom
R8  89.82,27.26 90 bottom
R9  72.04,38.06 270 bottom
R10  77.12,38.06 270 bottom
R11  79.66,38.06 270 bottom
R12  74.58,38.06 270 bottom
R13  19.02,46.31 0 bottom
R14  19.02,44.25 180 bottom
R15  47.27,39.64 225 bottom
R16  25.05,57.74 270 bottom
R17  70.77,14.56 0 top
R18  91.09,14.56 0 top
R19  94.9,29.17 180 bottom
R20  95.85,86.63 270 bottom
R21  18.06,61.23 180 bottom
R22  36.48,7.26 0 bottom
R23  36.48,3.13 0 bottom
R24  36.48,15.2 0 bottom
R25  36.48,11.07 0 bottom
R26  92.04,29.17 270 bottom
R27  40.61,3.13 0 bottom
R28  40.61,7.26 0 bottom
R29  40.61,15.2 0 bottom
R30  40.61,11.07 0 bottom
R31  95.54,72.66 0 bottom
R32  94.27,70.76 0 bottom
S2  73.31,5.67 270 top
S3  80.93,5.67 270 top
S4  88.55,5.67 270 top
S5  80.93,13.93 0 top
S6  7.59,37.42 180 top
S7  38.07,15.2 180 top
S8  38.07,11.07 180 top
S9  38.07,7.26 180 top
S10  38.07,3.13 180 top
SPK1  94.27,24.09 180 top
SV1  66.33,88.86 0 top
SV2  40.92,88.86 0 top
SV3  18.06,88.86 0 top
T1  21.56,60.28 0 bottom
T2  92.68,79.65 180 top
U2  21.24,12.97 270 bottom
U$1  6.95,45.68 180 bottom
U$2  92.68,86.63 270 top
U$3  33.3,48.22 180 bottom
U$4  14.26,25.99 0 top
VCCSELECT  82.84,88.86 180 top
WIRELESSCON  84.74,57.11 90 top

### Tracks (layer width: path | path; a pad name or v marks a point on that pad's centre or on a via)
+3V3  (via drill 0.3 pad 0.61, 0.6, 0.6 pad 1.27)
  Top 0.406: v91.73,25.04 SPK1.+
  Top 0.61: SPK1.+ 93,27.22 v93,31.39 89.19,31.39 JP8.2 | v54.26,2.82 52.99,1.55 33.3,1.55 v28.86,5.99
  Top 0.813: v54.26,63.46 77.12,40.6 v87.92,40.6 JP9.19
  Bottom 0.305: 21.24,10.12 20.29,9.16 U2.8
  Bottom 0.406: C4*.1 C4.+ | 59.34,8.53 56.8,8.53 | v91.73,25.04 91.73,23.08 D2.C
  Bottom 0.508: 21.24,10.12 21.24,16.15 21.88,16.78 U2.1 23.84,18.31 24.41,18.89 C28.1 | EXTRA.P$2 59.34,8.53
  Bottom 0.61: v87.92,40.6 93,35.52 v93,31.39 | v28.86,5.99 21.88,5.99 21.24,6.63 21.24,10.12 | 56.8,8.53 54.26,5.99 v54.26,2.82 | C25.+ 95.54,43.77
  Bottom 0.813: v54.26,63.46 IC2.4 | JP9.6 96.81,61.55 96.81,44.41 96.17,43.77 95.54,43.77 94.27,43.77 JP9.19
  Bottom 1.27: EXTRA.P$2 61.56,9.8 62.52,10.75 62.52,20.28 63.79,21.55 63.79,40.28 48.23,55.84 48.23,61.55 52.11,65.44 IC2.4
  Bottom 1.778: 54.18,65.36 IC2.4 IC2.2 C4.+ 54.26,75.52 57.12,78.38 74.26,78.38 81.57,85.68 VCCSELECT.4
+5V  (via drill 0.3 pad 0.61, 0.6)
  Top 0.406: v33.62,3.13 S10.P$2 S9.P$2 S8.P$2 S7.P$2 | v90.46,85.37 86.33,85.37 VCCSELECT.2
  Top 0.813: JP9.3 88.87,65.68 87.6,66.95 72.99,66.95 v69.5,63.46
  Top 1.27: v29.81,59.65 v29.18,60.28 25.05,60.28 24.1,61.24 24.1,66.32 25.37,67.59 44.73,67.59 v52.04,60.28
  Bottom 0.305: 18.64,18.63 C29.1 | 93.79,85.37 v90.46,85.37 | R32.2 93.31,70.12 93.95,69.49 93.95,66.95 JP9.3
  Bottom 0.406: U$3.34 37.3,42.31 C5.1 | U$3.2 26.61,45.02 26,44.41 26,42.5 26.06,42.45 L2.2 | C11.1 | 25.37,59.01 R16.1 | 18.64,18.63 C29.1 | C23*.1 C23.+ | C3*.1 68.23,62.5 | 25.36,58.7 R16.1 | v33.62,3.13 33.62,1.55 | 52.04,1.55 C9.1 C19.1 C20.1 C21.1 | R20.2 94.11,85.68 93.79,85.37 | 41.56,52.03 C16.1 | D1.C 24.6,58.69 R16.1 | 56.8,3.45 58.7,3.45 59.34,4.09 59.34,5.99 57.43,5.99 56.8,5.35 56.8,3.45
  Bottom 0.508: 29.81,56.79 30.9,55.7 U$3.14 30.9,52.21 30.76,52.06 30.76,47.25 | 29.81,56.79 29.49,57.11 | U$3.34 37.3,43.58 35.84,45.68 35.53,45.68 | 35.53,45.68 32.15,45.68 30.81,47.21 30.76,47.25 | U$3.2 28.53,45.02 30.76,47.25 | C29.1 17.11,18.69 16.48,18.06 16.48,8.53 19.97,5.04 27.91,5.04 31.4,1.55 33.62,1.55 52.04,1.55 54.89,1.55 55.53,2.18 | U2.14 18.64,18.63 | 41.56,52.03 40.95,51.42 U$3.24 36.5,51.42 35.84,50.76 35.84,45.99 35.53,45.68
  Bottom 0.61: C11.1 29.49,57.11 | 27.59,57.11 C11.1 | 29.81,59.01 v29.81,59.65 v29.18,60.28
  Bottom 0.813: 59.34,5.99 ICSP.2 | 67.28,60.28 68.23,61.24 | C23.+ 57.17,71.04 IC2.3 | 56.8,3.45 55.53,2.18 | 29.81,59.01 29.81,56.79 | 27.59,57.11 26,58.69 R16.1 25.05,59.01 22.88,60.92 T1.2 | v69.5,63.46 68.23,63.46
  Bottom 1.27: ICSP.2 61.4,7.26 64.26,10.12 64.26,19.64 65.37,20.75 65.37,58.06 68.23,60.92 68.23,61.24 68.23,62.5 68.23,63.46 IC1.4 68.56,65.11 | v52.04,60.28 67.28,60.28
  Bottom 1.778: IC1.4 IC1.2 C3.+ | VCCSELECT.2 84.11,84.41 75.19,75.5 C3.+ | IC2.3 56.57,73.07 59,75.5 C3.+
+UB
  Top 0.406: S2.3 66.05,3.45 57.12,3.45 56.48,4.09 56.48,6.78 54.89,8.37 50.61,8.37 JP7.P$1
  Bottom 0.813: 86.65,5.67 91.09,5.67 93.63,8.21 R18.E | 86.65,5.67 79.03,5.67 | 79.03,5.67 72.04,5.67 71.05,6.66 S2.3 71.05,9.76 R17.E | 79.03,5.67 78.67,6.03 S3.3 78.63,10.55 S5.3 | S4.3 86.29,6.03 86.65,5.67
  Bottom 1.27: VCCSELECT.1 86.01,88.22 86.01,81.87 85.06,80.92 PROTOBOARD.P$1 83.79,80.92 81.88,79.01 81.88,67.59 68.23,53.93 68.23,19.33 67.59,18.69 67.59,15.83 R17.E
  Bottom 1.778: JP5.2 JP5.1 80.3,91.4 VCCSELECT.3 VCCSELECT.1
A0
  Bottom 0.406: ANALOG.1 56.48,17.42 51.88,21.39 50.13,25.52 46.32,30.91 38.07,37.74 35.7,40.1 U$3.36
A1
  Bottom 0.406: ANALOG.2 59.34,16.15 56.48,16.15 51.09,20.91 49.34,25.2 45.53,30.6 37.75,36.95 34.91,39.79 U$3.37
A2
  Bottom 0.406: U$3.38 34.1,39.48 37.43,36.15 44.73,30.28 48.55,24.88 50.29,20.44 56.48,14.88 ANALOG.3
A3
  Bottom 0.406: ANALOG.4 59.34,13.61 56.48,13.61 49.5,19.96 47.75,24.56 43.94,29.96 37.12,35.36 33.3,39.17 U$3.39
A4
  Bottom 0.406: U$3.40 32.5,38.86 36.8,34.56 43.15,29.64 46.96,24.25 48.7,19.48 56.48,12.34 ANALOG.5
A5
  Bottom 0.406: ANALOG.6 59.34,11.07 56.48,11.07 47.91,19.01 46.16,23.93 42.35,29.33 36.48,33.77 31.7,38.55 U$3.41
AGND  (via drill 0.3 pad 0.61)
  Top 0.406: v28.54,39.64 28.54,39.33 | v48.39,15.99 49.02,16.63
  Bottom 0.406: U$3.43 30.1,41.21 v28.54,39.64 C10.2 28.54,38.06 27.91,37.42 | C24.2 27.59,37.1 27.91,37.42 | 30.13,36.79 28.54,36.79 27.91,37.42 | L3.1 48.69,15.69 v48.39,15.99
  other vias: 29.18,40.28
  pour Top (isolate 0.305): 26,39.59 27.75,41.23 28.86,41.87 35.84,41.87 35.84,40.28 38.23,37.9 46.48,30.91 50.29,25.67 52.04,21.55 56.16,18.05 61.4,18.05 61.4,11.07 59.02,11.07 59.02,9.01 56.96,9.01 54.26,11.55 46.8,18.53 45.21,23.29 41.4,28.69 36.16,32.66 32.35,36.47 26,36.47
  pour Bottom (isolate 0.305): 26,39.59 27.75,41.23 28.86,41.87 35.84,41.87 35.84,40.28 38.23,37.9 46.48,30.91 50.29,25.67 52.04,21.55 56.16,18.05 61.4,18.05 61.4,11.07 59.02,11.07 59.02,9.01 56.96,9.01 54.26,11.55 46.8,18.53 45.21,23.29 41.4,28.69 36.16,32.66 32.35,36.47 26,36.47
AREF
  Bottom 0.406: U$3.42 30.9,38.69 | 30.9,38.69 30.9,38.24 36.16,32.98 41.56,28.85 45.37,23.45 47.12,18.53 51.37,14.55 | C10.1 30.9,38.69 | EXTRA.P$1 56.48,9.8 54.74,11.39 51.37,14.55 | JP7.P$2 51.37,14.55
AVCC
  Bottom 0.406: C24.1 26.64,39.81 L2.1 29.18,41.55 29.3,41.68 U$3.44
B_AR_C
  Bottom 0.406: R28.1 42.35,7.26 42.99,7.89 BOTONS.P$3 45.21,6.31 46.32,6.31 47.59,5.04 C20.2
B_AR_D
  Bottom 0.406: R27.1 41.56,3.45 BOTONS.P$4 44.26,4.72 C21.2
B_ESC
  Bottom 0.406: R29.1 BOTONS.P$1 50.29,6.31 50.77,6.31 52.04,5.04 C9.2
B_OK
  Bottom 0.406: R30.1 42.35,11.07 42.99,10.44 BOTONS.P$2 46.8,7.26 47.59,7.26 49.81,5.04 C19.2
BUZZER  (via drill 0.3 pad 0.61)
  Top 0.406: v91.09,30.12 86.65,30.12 86.01,30.76 JP8.4
  Bottom 0.406: R26.1 v91.09,30.12
CN_A1
  Bottom 0.406: U2.2 25.37,15.51 35.21,25.36 35.21,25.99 JP6.1
CN_A2
  Bottom 0.406: U2.3 25.37,14.24 36.16,25.04 JP6.3
CN_A3
  Bottom 0.406: U2.4 25.37,12.97 34.89,22.5 JP6.5
CN_A4
  Bottom 0.406: U2.5 25.37,11.71 33.62,19.96 JP6.7
CN_B1  (via drill 0.3 pad 0.61)
  Top 0.406: JP6.2 38.07,26.31 36.16,26.31 25.37,15.51 v19.97,15.51
  Bottom 0.406: v19.97,15.51 U2.13
CN_B2  (via drill 0.3 pad 0.61)
  Top 0.406: v19.97,14.24 25.37,14.24 34.89,23.77 38.07,23.77 JP6.4
  Bottom 0.406: v19.97,14.24 U2.12
CN_B3  (via drill 0.3 pad 0.61)
  Top 0.406: v19.97,12.97 25.37,12.97 33.62,21.23 37.91,21.23 JP6.6
  Bottom 0.406: v19.97,12.97 U2.11
CN_B4  (via drill 0.3 pad 0.61)
  Top 0.406: v19.97,11.71 25.37,11.71 32.35,18.69 38.07,18.69 JP6.8
  Bottom 0.406: v19.97,11.71 U2.10
D0
  Bottom 0.254: DIGITAL.1 58.07,43.46 43.15,58.38 37.12,58.38 35.7,56.97 U$3.20
D1
  Bottom 0.254: U$3.21 36.5,56.5 37.75,57.74 42.83,57.74 56.8,43.77 56.8,37.1 57.43,36.47 59.34,36.47 DIGITAL.2
D2  (via drill 0.3 pad 0.61)
  Top 0.254: v35.21,57.74 42.51,57.74 49.81,49.81 49.81,48.85 59.34,39.64 59.34,37.1 58.07,35.84 DIGITAL.3
  Bottom 0.254: U$3.19 34.91,57.44 v35.21,57.74
D3
  Bottom 0.254: DIGITAL.4 61.4,35.2 62.36,36.15 62.36,40.12 43.46,59.01 35.21,59.01 34.1,57.91 U$3.18
D4
  Bottom 0.254: DIGITAL.5 57.12,32.66 55.21,34.56 55.21,41.23 45.83,50.62 U$3.25
D5  (via drill 0.3 pad 0.61)
  Top 0.254: v56.01,35.04 51.56,39.17 v51.24,39.49
  Bottom 0.254: DIGITAL.6 59.34,33.93 57.12,33.93 v56.01,35.04 | U$3.31 44.91,45.82 v51.24,39.49
D6
  Bottom 0.254: DIGITAL.7 57.12,30.12 53.94,33.29 53.94,40.6 45.52,49.02 U$3.27
D7  (via drill 0.3 pad 0.61)
  Top 0.254: v27.75,42.5 45.05,42.5 56.8,31.39 59.34,31.39 DIGITAL.8
  Bottom 0.254: 27.72,44.22 27.72,42.53 v27.75,42.5
  Bottom 0.406: U$3.1 27.72,44.22
D8
  Bottom 0.254: U$3.28 45.37,48.22 53.31,40.28 53.31,32.34 DIGITAL.9
D9
  Bottom 0.254: U$3.29 45.22,47.42 52.67,39.96 52.67,31.07 57.43,26.31 59.34,26.31 DIGITAL.10
D10
  Bottom 0.254: DIGITAL.11 57.75,25.04 52.04,30.76 52.04,39.64 45.06,46.62 U$3.30
D11  (via drill 0.3 pad 0.61)
  Top 0.254: DIGITAL.12 61.24,25.04 62.83,26.63 62.83,38.53 42.83,58.38 34.89,58.38 31.4,54.88 28.86,54.88
  Top 0.406: v28.83,54.85 28.86,54.88
  Bottom 0.254: 28.99,54.34 U$3.12 28.79,54.54 v28.83,54.85
D12
  Bottom 0.254: DIGITAL.13 59.34,23.77 61.24,23.77 62.04,24.56 62.04,30.6 61.24,31.39 57.12,31.39 54.58,33.93 54.58,40.92 45.67,49.82 U$3.26
D13
  Bottom 0.254: DIGITAL.14 59.34,21.23 57.43,21.23 56.16,22.5 56.16,25.67 51.4,30.44 51.4,38.38 44.76,45.02 U$3.32
D17  (via drill 0.3 pad 0.61)
  Top 0.254: v29.02,49.81 29.02,44.73 29.65,44.09 44.26,44.09 v44.58,44.25
  Bottom 0.254: U$3.8 28.87,49.82 v29.02,49.81 | v44.58,44.25 50.77,38.06 50.77,30.12 55.53,25.36 55.53,22.18 57.75,19.96 DIGITAL.15
D30  (via drill 0.3 pad 0.61)
  Top 0.254: v62.04,34.09 62.04,38.38 v50.45,49.17
  Bottom 0.254: U$3.22 37.3,56.03 38.38,57.11 42.51,57.11 v50.45,49.17 | DIGITAL.16 62.67,22.02 62.67,33.45 v62.04,34.09
D+
  Bottom 0.305: U$1.D+ 10.77,45.68 arc53 11.17,45.81 arc-53 11.46,45.92 17.67,45.92 R13.2
D-
  Bottom 0.305: U$1.D- 10.82,44.88 arc-43 11.19,44.75 arc33 11.46,44.64 17.67,44.64 R14.1
DISP_SCL
  Top 0.406: DISPLAYCON.P$2 DISP2.P$3
  Bottom 0.406: DISP2.P$3 23.14,24.56 21.4,22.82 16,22.82 12.99,25.83 U$4.P$3
DISP_SDA
  Top 0.406: DISPLAYCON.P$3 DISP2.P$4 25.68,25.99 24.1,24.4 17.11,24.4 U$4.P$4
DISP_SS
  Top 0.406: DISPLAYCON.P$1 DISP2.P$2 U$4.P$5
DISP_VDD
  Top 0.813: DISPLAYCON.P$4 DISP2.P$5 28.22,25.36 25.37,22.5 10.45,22.5 7.91,25.04 U$4.P$1
  Bottom 0.61: C22.+ 28.22,26.59 DISP2.P$5
GND  (via drill 0.3 pad 0.61)
  Top 0.61: LED8.C LED7.C LED6.C LED5.C LED4.C LED3.C LED2.C LED1.C
  Bottom 0.254: 38.7,42.66 38.07,43.61 37.43,45.04
  Bottom 0.406: 31.4,57.74 31.7,57.44 U$3.15 31.7,52.99 32.03,52.66 | v36.66,41.05 38.38,39.01 | U$3.23 39.53,52.22 40.92,53.61 42.83,53.61 43.78,52.67 C16.2
  Bottom 0.508: 35.84,44.09 36.5,43.43 U$3.35 36.5,41.21 v36.66,41.05
  other vias: 31.72,47.58 34.89,46.63 40.95,40.57 46.8,59.65 20.94,52.91 16.64,49.96 25.37,8.37 29.81,47.58 30.76,45.99 43.94,53.46 31.88,52.66 49.81,59.65 15.68,52.82 35.23,44.7 59.34,19.17 2.03,52.82 2.03,38.85 16.32,38.85 24.57,42.03 31.08,59.01 48.89,38.03 52.99,6.15 39.66,43.3
  pour Bottom (isolate 0.305, rank 2): -0.35,-0.68 98.71,-0.68 98.71,99.02 -0.35,99.02
  pour Top (isolate 0.305, rank 2): -0.35,-0.68 98.71,-0.68 98.71,99.02 -0.35,99.02
HWB
  Bottom 0.254: U$3.33 43.34,44.22 45.05,42.5 45.05,36.47 JP4.P$2
  Bottom 0.406: U$3.33 39.21,44.22
MISO  (via drill 0.3 pad 0.61)
  Top 0.254: v25.68,52.98 25.68,53.46 27.75,55.52 31.24,55.52 34.73,59.01 43.15,59.01 63.47,38.85 63.47,9.8 62.2,8.53 59.34,8.53 ICSP.1
  Bottom 0.254: U$3.11 26.45,52.22 v25.68,52.98
MOSFET_BASE
  Bottom 0.406: Q1.1 R26.2 R19.1
MOSI  (via drill 0.3 pad 0.61)
  Top 0.254: v24.41,54.25 24.89,54.25 27.43,56.79 30.92,56.79 34.42,60.28 43.94,60.28 64.74,39.49 64.74,8.05 61.4,4.72 ICSP.4
  Bottom 0.254: U$3.10 26.29,51.42 25.05,52.66 25.05,53.61 v24.41,54.25
N$1  (via drill 0.3 pad 0.61)
  Top 0.406: LED1.A v72.04,25.36
  Bottom 0.406: v72.04,25.36 R1.1
N$2  (via drill 0.3 pad 0.61)
  Top 0.406: LED2.A v74.58,25.36
  Bottom 0.406: v74.58,25.36 R2.1
N$3  (via drill 0.3 pad 0.61)
  Top 0.406: LED3.A v77.12,25.36
  Bottom 0.406: v77.12,25.36 R3.1
N$4  (via drill 0.3 pad 0.61)
  Top 0.406: LED4.A v79.66,25.36
  Bottom 0.406: v79.66,25.36 R4.1
N$5
  Bottom 0.406: JP8.13 74.58,33.29 R2.2
N$6
  Bottom 0.406: JP8.11 77.12,33.29 R3.2
N$7
  Bottom 0.406: JP8.15 72.04,33.29 R1.2
N$8
  Bottom 0.406: JP8.9 79.66,33.29 R4.2
N$9  (via drill 0.5 pad 1.02)
  Top 0.406: v95.85,88.86 LED9.A
  Bottom 0.406: R20.1 v95.85,88.86
N$10
  Bottom 0.406: JP8.6 83.47,21.55 R18.S C27.1
N$11  (via drill 0.3 pad 0.61)
  Top 0.406: SPK1.- v93.63,21.23
  Bottom 0.406: Q1.3 93.31,21.55 v93.63,21.23 94.53,22.13 D2.A
N$12
  Bottom 0.406: JP4.P$1 46.25,39.96 R15.1
N$13
  Bottom 0.406: U$3.17 33.3,61.24 34.26,62.19 | 34.26,62.19 36.48,62.5 Q2.2 | C13.1 36.16,62.19 34.26,62.19
N$14
  Bottom 0.406: U$3.16 32.5,61.4 31.4,62.5 | 31.4,62.5 Q2.1 | C14.2 29.18,62.82 31.4,62.5
N$15  (via drill 0.3 pad 0.61)
  Top 0.406: S9.P$1 v39.02,7.26
  Bottom 0.406: R22.1 v39.02,7.26 R28.2
N$16  (via drill 0.3 pad 0.61)
  Top 0.406: JP8.8 79.66,33.29 v79.66,35.84
  Bottom 0.406: S4.1 91.09,9.2 91.09,13.61 85.69,18.06 80.93,20.91 JP8.8 | v79.66,35.84 R11.2
N$17  (via drill 0.3 pad 0.61)
  Top 0.406: JP8.12 74.58,33.29 v74.58,35.84
  Bottom 0.406: S5.1 75.85,19.29 JP8.12 | v74.58,35.84 R12.2
N$18  (via drill 0.3, 0.3 pad 0.61)
  Top 0.406: v11.71,50.76 11.71,44.41 v10.76,43.46
  Bottom 0.406: C15.1 v11.72,50.75 v11.71,50.76 | v10.76,43.46 v10.76,43.44 10.13,44.08
  Bottom 0.508: U$1.VBUS 10.13,44.08 10.46,44.08 10.45,44.09 11.4,42.83 PTC.1
N$19  (via drill 0.3 pad 0.61)
  Top 0.406: S7.P$1 v39.02,15.2
  Bottom 0.406: R24.1 v39.02,15.2 R29.2
N$20  (via drill 0.3 pad 0.61)
  Top 0.406: LED5.A v82.2,25.36
  Bottom 0.406: v82.2,25.36 R5.1
N$23  (via drill 0.3 pad 0.61)
  Top 0.406: S8.P$1 v39.02,11.07
  Bottom 0.406: R25.1 v39.02,11.07 R30.2
N$25  (via drill 0.3 pad 0.61)
  Top 0.406: JP8.10 77.12,33.29 v77.12,35.84
  Bottom 0.406: S3.1 80.93,11.18 80.93,16.47 78.39,20.28 JP8.10 | v77.12,35.84 R10.2
N$26  (via drill 0.3 pad 0.61)
  Top 0.406: v39.02,3.13 S10.P$1
  Bottom 0.406: R23.1 v39.02,3.13 39.98,3.13 R27.2
N$27
  Bottom 0.406: U$3.6 23.78,48.22 C12.1
N$39
  Bottom 0.305: R32.1 JP9.2
N$40
  Bottom 0.305: R31.1 96.49,67.59 96.49,66.63 JP9.4
N$42
  Bottom 1.778: DC_IN.2 92.68,91.08 U$2.PA U$2.PCOM
N$44  (via drill 0.3 pad 0.61)
  Top 0.406: LED6.A v84.74,25.36
  Bottom 0.406: v84.74,25.36 R6.1
N$45  (via drill 0.3 pad 0.61)
  Top 0.406: LED7.A v87.28,25.36
  Bottom 0.406: v87.28,25.36 R7.1
N$46  (via drill 0.3 pad 0.61)
  Top 0.406: LED8.A v89.82,25.36
  Bottom 0.406: v89.82,25.36 R8.1
N$47  (via drill 0.3 pad 0.61)
  Top 0.406: JP8.14 72.04,33.29 v72.04,35.84
  Bottom 0.406: S2.1 75.53,8.96 75.53,14.88 73.31,19.01 JP8.14 | v72.04,35.84 R9.2
N$57
  Bottom 0.406: R17.S 70.77,21.55 | 70.77,21.55 JP8.16 | C26.1 70.77,21.55
N$62
  Bottom 0.406: JP8.5 84.74,33.29 R6.2
N$63
  Bottom 0.406: JP8.3 87.28,33.29 R7.2
N$64
  Bottom 0.406: JP8.7 82.2,33.29 R5.2
N$65
  Bottom 0.406: JP8.1 89.82,33.29 R8.2
P01
  Bottom 0.406: JP1.1 SV1.1
P02
  Bottom 0.406: JP1.2 53.62,94.57 53.62,88.86 SV1.2
P04
  Bottom 0.406: JP1.3 SV1.3
P05
  Bottom 0.406: JP1.4 56.16,94.57 56.16,88.86 SV1.4
P07
  Bottom 0.406: JP1.5 SV1.5
P08
  Bottom 0.406: JP1.6 58.7,94.57 58.7,88.86 SV1.6
P10
  Bottom 0.406: JP1.7 SV1.7
P11
  Bottom 0.406: JP1.8 61.24,94.57 61.24,88.86 SV1.8
P13
  Bottom 0.406: JP1.9 SV1.9
P14
  Bottom 0.406: JP1.10 63.79,94.57 63.79,88.86 SV1.10
P16
  Bottom 0.406: JP1.11 SV1.11
P17
  Bottom 0.406: JP1.12 66.33,94.57 66.33,88.86 SV1.12
P19
  Bottom 0.406: JP1.13 SV1.13
P20
  Bottom 0.406: JP1.14 68.87,94.57 68.87,88.86 SV1.14
P22
  Bottom 0.406: JP1.15 SV1.15
P23
  Bottom 0.406: JP1.16 71.41,94.57 71.41,88.86 SV1.16
P25
  Bottom 0.406: JP1.17 SV1.17
P26
  Bottom 0.406: JP1.18 73.95,94.57 73.95,88.86 SV1.18
P28
  Bottom 0.406: JP1.19 SV1.19
P29
  Bottom 0.406: JP1.20 76.48,94.57 76.48,88.86 SV1.20
P31
  Bottom 0.406: JP2.1 SV2.1
P32
  Bottom 0.406: JP2.2 28.22,94.57 28.22,88.86 SV2.2
P34
  Bottom 0.406: JP2.3 SV2.3
P35
  Bottom 0.406: JP2.4 30.76,94.57 30.76,88.86 SV2.4
P37
  Bottom 0.406: JP2.5 SV2.5
P38
  Bottom 0.406: JP2.6 33.3,94.57 33.3,88.86 SV2.6
P40
  Bottom 0.406: JP2.7 SV2.7
P41
  Bottom 0.406: JP2.8 35.84,94.57 35.84,88.86 SV2.8
P43
  Bottom 0.406: JP2.9 SV2.9
P44
  Bottom 0.406: JP2.10 38.38,94.57 38.38,88.86 SV2.10
P46
  Bottom 0.406: JP2.11 SV2.11
P47
  Bottom 0.406: JP2.12 40.92,94.57 40.92,88.86 SV2.12
P49
  Bottom 0.406: JP2.13 SV2.13
P50
  Bottom 0.406: JP2.14 43.46,94.57 43.46,88.86 SV2.14
P52
  Bottom 0.406: JP2.15 SV2.15
P53
  Bottom 0.406: JP2.16 46,94.57 46,88.86 SV2.16
P55
  Bottom 0.406: JP2.17 SV2.17
P56
  Bottom 0.406: JP2.18 48.55,94.57 48.55,88.86 SV2.18
P58
  Bottom 0.406: JP2.19 SV2.19
P59
  Bottom 0.406: JP2.20 51.09,94.57 51.09,88.86 SV2.20
P67
  Bottom 0.406: JP3.1 SV3.1
P68
  Bottom 0.406: JP3.2 7.91,94.57 7.91,88.86 SV3.2
P70
  Bottom 0.406: JP3.3 SV3.3
P71
  Bottom 0.406: JP3.4 10.45,94.57 10.45,88.86 SV3.4
P73
  Bottom 0.406: JP3.5 SV3.5
P74
  Bottom 0.406: JP3.6 12.99,94.57 12.99,88.86 SV3.6
P76
  Bottom 0.406: JP3.7 SV3.7
P77
  Bottom 0.406: JP3.8 15.53,94.57 15.53,88.86 SV3.8
P79
  Bottom 0.406: JP3.9 SV3.9
P80
  Bottom 0.406: JP3.10 18.06,94.57 18.06,88.86 SV3.10
P82
  Bottom 0.406: JP3.11 SV3.11
P83
  Bottom 0.406: JP3.12 20.6,94.57 20.6,88.86 SV3.12
P85
  Bottom 0.406: JP3.13 SV3.13
P86
  Bottom 0.406: JP3.14 23.14,94.57 23.14,88.86 SV3.14
P88
  Bottom 0.406: JP3.15 SV3.15
P89
  Bottom 0.406: JP3.16 25.68,94.57 25.68,88.86 SV3.16
RD+
  Bottom 0.305: U$3.4 25.84,46.63 arc61 24.89,46.15 arc-38 23.94,45.84 20.44,45.84 R13.1
RD-
  Bottom 0.305: U$3.3 25.84,45.68 arc65 25.21,45.2 arc-61 24.41,44.57 20.29,44.57 R14.2
RESET  (via drill 0.3 pad 0.61)
  Top 0.254: v24.57,56.16 26,56.16 27.27,57.42 30.76,57.42 34.26,60.92 44.1,60.92 65.37,39.8 65.37,7.58 v63.63,5.83
  Top 0.406: v2.51,55.84 0.6,53.93 0.6,38.69 1.87,37.42 S6.P$2
  Bottom 0.254: v63.63,5.83 61.24,3.45 59.98,3.45 58.7,2.18 ICSP.5
  Bottom 0.406: U$3.13 30.1,55.23 29.49,55.84 25.37,55.84 | 25.37,55.84 24.57,55.84 | R16.2 25.37,55.84 | v24.57,56.16 24.57,55.84 | 24.57,55.84 19.33,55.84 | 19.33,55.84 v2.51,55.84 | D1.A 19.33,57.13 19.33,55.84
SCK  (via drill 0.3 pad 0.61)
  Top 0.254: v24.41,52.98 27.59,56.16 31.08,56.16 34.57,59.65 43.62,59.65 64.1,39.17 64.1,8.85 61.24,5.99 59.34,5.99 ICSP.3
  Bottom 0.254: U$3.9 25.82,50.62 24.41,52.03 v24.41,52.98
UGND  (via drill 0.3)
  Top 0.254: 9.18,48.22 v9.33,48.38
  Bottom 0.254: v9.33,48.38 9.33,49.96 U$1.MTN4
  Bottom 0.406: U$3.5 24.57,47.42 24.26,47.11 21.56,47.11 | 14.57,47.9 15.05,48.38 20.76,48.38 21.56,47.58 21.56,47.11 | 14.57,47.9 12.67,47.9 | 12.67,47.9 12.03,47.27 9.46,47.27 U$1.GND | L1.1 14.57,47.9 | C15.2 12.67,47.9 | C12.2 21.51,47.22 21.56,47.11
  Bottom 0.508: 11.08,40.12 10.29,40.6 U$1.MTN2
  Bottom 0.813: U$1.MTN4 U$1.MTN3 U$1.MTN1 U$1.MTN2
  other vias: 3.14,39.96 15.53,49.01 17.27,41.55 3.14,51.71 20.45,48.85 15.84,39.96 15.53,51.71 23.14,43.77 26,47.42
  pour Bottom (isolate 0.305): 2.82,52.03 15.84,52.03 15.84,49.17 24.1,49.17 24.1,48.38 27.27,48.38 27.27,44.72 26.32,44.72 25.37,43.45 15.84,39.64 2.82,39.64
  pour Top (isolate 0.305): 2.82,52.03 15.84,52.03 15.84,49.17 24.1,49.17 24.1,48.38 27.27,48.38 27.27,44.72 26.32,44.72 25.37,43.45 15.84,39.64 2.82,39.64
V+
  Top 1.778: U$2.PB 92.68,80.69 T2.1
VBUS  (via drill 0.3 pad 0.61)
  Top 0.61: v25.21,43.61 26.95,45.2 26.95,48.38 26.32,49.01 v25.37,49.01
  Top 0.813: v22.19,59.33 22.19,52.19 v25.37,49.01
  Bottom 0.406: v25.37,49.01 v25.36,49.02 U$3.7 25.52,49.02 24.73,49.81 23.46,49.81 22.85,50.42 C18.2 C17.1
  Bottom 0.508: 15.37,41.71 PTC.2
  Bottom 0.61: 15.37,41.71 17.11,40.44 v25.21,43.61 | 22.13,59.27 v22.19,59.33
  Bottom 0.813: T1.1 22.13,59.27
VCC  (via drill 0.3 pad 0.61, 0.7 pad 1.68)
  Top 0.406: C1.+ 89.82,73.62 | v39.97,72.98 v70.45,72.98
  Top 1.778: T2.2 93.62,76.46 90.77,73.62 89.82,73.62 88.87,72.98 v70.45,72.98
  Bottom 0.406: IC1.3 70.54,72.12 | C2*.1 C2.+ | C6.1 72.29,68.54 | 72.29,68.54 71.09,71.65 | C7.1 72.36,68.47 72.29,68.54 | C8.1 87.28,72.35 89.69,72.35 C1.+ | R21.2 20.5,61.24 T1.3 20.57,71.2 22.19,72.98 v39.97,72.98
  Bottom 0.813: C2.+ 73.03,71.69 71.09,71.65 IC1.3
  Bottom 1.778: v70.45,72.98 70.45,73 IC1.3
WC1
  Top 0.406: JP9.13 92.36,52.98 88.55,56.79 88.55,59.65 | 88.55,59.65 WIRELESSCON.P$6 | JP9.8 93.95,59.33 88.87,59.33 88.55,59.65
  Bottom 0.406: JP9.1 89.5,68.22 WIRELESSCON.P$6
WC2
  Top 0.406: JP9.16 93.95,51.71 92.04,51.71 87.6,56.16 87.6,58.06 WIRELESSCON.P$5
  Bottom 0.406: WIRELESSCON.P$5 88.55,60.92 88.87,60.6 JP9.7
WC3
  Top 0.406: JP9.15 91.73,50.44 86.65,55.52 86.65,56.47 WIRELESSCON.P$4
  Bottom 0.406: WIRELESSCON.P$4 88.55,58.38 88.87,58.06 JP9.9
WC4
  Top 0.406: JP9.18 93.95,49.17 91.41,49.17 WIRELESSCON.P$3
  Bottom 0.406: WIRELESSCON.P$3 90.14,55.84 91.09,56.79 93.95,56.79 JP9.10
WC5
  Top 0.406: JP9.17 91.09,47.9 85.69,53.3 WIRELESSCON.P$2
  Bottom 0.406: WIRELESSCON.P$2 89.19,53.3 91.41,55.52 JP9.11
WC6
  Bottom 0.406: JP9.12 93.95,54.25 91.73,54.25 88.23,50.76 87.6,50.76 | JP9.20 93.95,46.63 91.73,46.63 87.6,50.76 | WIRELESSCON.P$1 87.6,50.76
(copper drawn outside any net)
  shapes: Bottom circle x1

### Text on the board
Bottom: Ardu-Trainer MultiMicro | 64 pin version | erobot.cat | Mµ
_tsilk: + | - | B | VIN+ | B | A | A | - | + | A | OFF | B | PWR | VCC | 28 | 27 | 26 | 25 | 24 | 23 | 22 | 21 | 20 | 19 | 18 | 17 | 16 | 15 | 14 | 13 | 12 | 11 | 10 | 9 | 8 | 7 | 6 | 5 | 4 | 3 | 2 | 1 | 3.3 | 5.0 | Select | VCC | ON | T2 | GND | C1 | R32 | HC-06 | 1 | 2 | 2 | NRF24L01 | A | 3 | 1 | 4 | 4 | B | 3 | 6 | 5 | C | 5 | 6 | 8 | D | 7 | 2 | E | 1 | 4 | F | 3 | 6 | 5 | 8 | 7 | USB | BOOT | Display: | D0 | Reset | D1 | LEDS: | AVR | SS | D2 | 1 | 2 | 3 | 4 | 5 | 6 | 7 | 8 | ESP8266 | SCK | SCL | Ardu-Trainer | D3# | SDI | SDA | RX | D4 | D5# | MultiMicro | SPI | I2C | SER | #D6 | P1 | B1 | B2 | B3 | B4 | P2 | BUZ | 3.3V | VCC | D7 | 1 | D8 | 1 | D9# | 2 | #D10 | 2 | D11# | 3 | D12 | 3 | D13# | Mµ | 1 | 2 | 3 | 4 | 5 | 6 | 7 | 8 | 4 | RXL | 4 | TXL | 2 | BUZ | (4/6 pin) | 3.3V | A0 | 5.0V | SSD1306: | A1 | A2 | DIGOLE: | VCC | A3 | A4 | (0.96/1.3") | A | A5 | AREF | 1 | 2 | B | 3.3V | MISO | C | 5.0V | SCK | D | MOSI | RESET | 1 | 3 | 4 | GND
_bsilk: +VIN | R20 | Ardu-Trainer MultiMicro | +C4 | +C3 | 64 pin version | CC by nc sa | R31 | C23+ | dragonet80 - 2015 | C2+ | C8 | VR3.3 | VR5.0 | Colabora: UCfort, JMN | C6 | C7 | C13 | C14 | +C3* | R21 | R16 | 1: | 4: | 1: | KEY | CSN | TX | A | 4: | 3: | 4: | D1 | C11 | TX | CE | GP2 | B | L1 | 5: | 5: | 3: | C16 | RX | SCK | CHPD | C | USBMINI | 6: | 6: | 6: | C15 | C17 | C18 | STA | MOSI | GP0 | D | 7: | 5: | MISO | RST | E | C12 | 8: | 8: | HC-06 | NRF24L01 | ESP8266 | R13 | IRQ | RX | F | 2: | 2: | 7: | R14 | 5V | 3.3V | 3.3V | L2 | R15 | 3: | 1: | 2: | C25+ | PTC | GND | GND | GND | C24 | C5 | PD3 | C10 | PD2 | PD0 | R9 | R12 | R10 | R11 | PD1 | PC6 | PE2 | PD4 | R26 | R19 | PE6 | PD7 | PB5 | PB4 | Q1 | PB7 | PB6 | PC7 | PD6 | C26 | R1 | R2 | R3 | R4 | R5 | R6 | R7 | R8 | +C22 | D2 | PD5 | PB0 | C29 | C28 | PF6 | C27 | R24 | R29 | L3 | PF7 | PF4 | PF5 | P1 | P2 | PF0 | B2 | R25 | R30 | PF1 | 3.3V | AREF | U1 | R22 | R28 | 5.0V | PB3 | C21 | C20 | C19 | C9 | PB2 | B1 | B3 | B4 | R23 | R27 | PB1 | GND | RST